# Altium project PPC_notebook_electrical_schematics_v0.6.PrjPcb (part 8 of 10)

## Sheet 27 Clock 2.SchDoc
size 420 x 297 mm
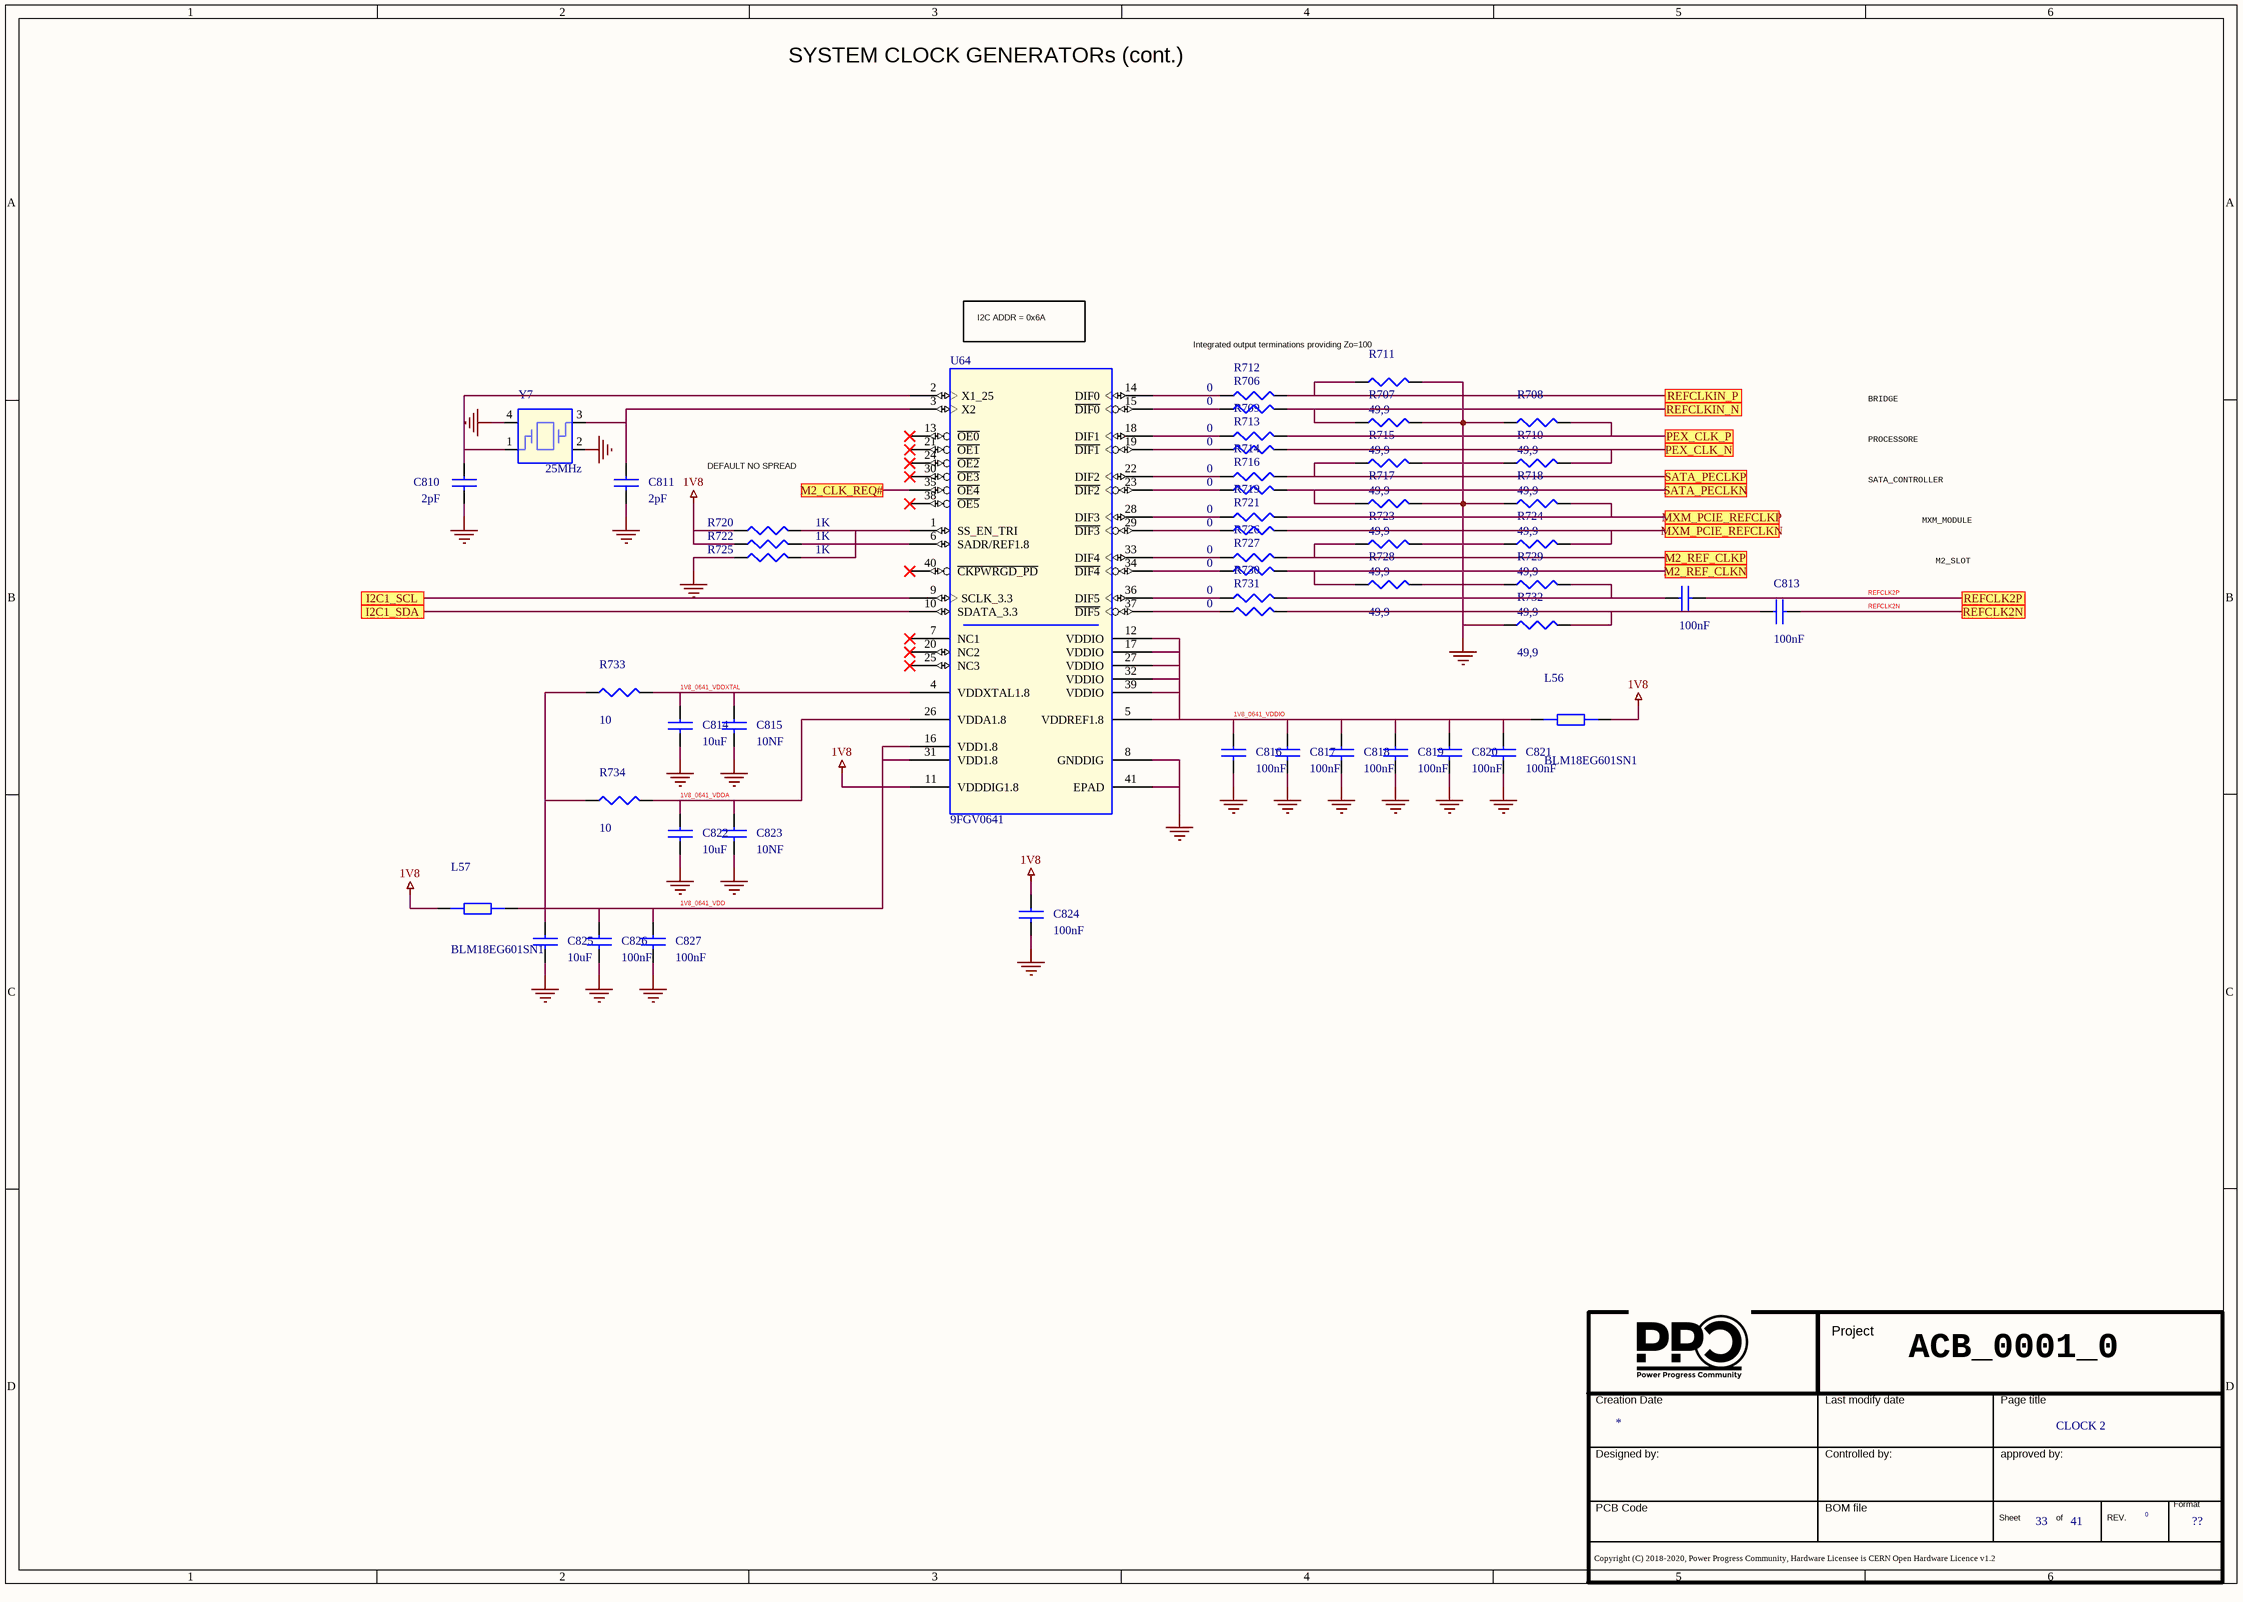
[diagram p59: 27 Clock 2.SchDoc]

### Parts
(Parts that share a designator on the sheet are numbered #1, #2 ... from top to bottom, then left to right.)
*#36  Doc: CLOCK 2  Page Count: 41  Page Number: 33  Page Size: ??  RevCode: 0  (hidden comment: Title_block_PPC)  (graphical)
C810  2pF  [SMD_0402]
C811  2pF  [SMD_0402]
C812  100nF  [SMD_0402]
C813  100nF  [SMD_0402]
C814  10uF  [SMD_0603]
C815  10NF  [SMD_0402]
C816  100nF  [SMD_0402]
C817  100nF  [SMD_0402]
C818  100nF  [SMD_0402]
C819  100nF  [SMD_0402]
C820  100nF  [SMD_0402]
C821  100nF  [SMD_0402]
C822  10uF  [SMD_0603]
C823  10NF  [SMD_0402]
C824  100nF  [SMD_0402]
C825  10uF  [SMD_0603]
C826  100nF  [SMD_0402]
C827  100nF  [SMD_0402]
L56  BLM18EG601SN1  [SMD_0603]
L57  BLM18EG601SN1  [SMD_0603]
R706  0  [SMD_0402]
R707  49,9  [SMD_0402]
R708  49,9  [SMD_0402]
R709  0  [SMD_0402]
R710  49,9  [SMD_0402]
R711  49,9  [SMD_0402]
R712  0  [SMD_0402]
R713  0  [SMD_0402]
R714  0  [SMD_0402]
R715  49,9  [SMD_0402]
R716  0  [SMD_0402]
R717  49,9  [SMD_0402]
R718  49,9  [SMD_0402]
R719  0  [SMD_0402]
R720  1K  [SMD_0402]
R721  0  [SMD_0402]
R722  1K  [SMD_0402]
R723  49,9  [SMD_0402]
R724  49,9  [SMD_0402]
R725  1K  [SMD_0402]
R726  0  [SMD_0402]
R727  0  [SMD_0402]
R728  49,9  [SMD_0402]
R729  49,9  [SMD_0402]
R730  0  [SMD_0402]
R731  0  [SMD_0402]
R732  49,9  [SMD_0402]
R733  10  [SMD_0402]
R734  10  [SMD_0402]
U64  9FGV0641  [qfn_p040_d040_b500_40_e380]
Y7  25MHz  [SMD_5.0x3.2]

### Ports
I2C1_SCL, I2C1_SDA, M2_CLK_REQ#, M2_REF_CLKN, M2_REF_CLKP, MXM_PCIE_REFCLKN, MXM_PCIE_REFCLKP, PEX_CLK_N, PEX_CLK_P, REFCLK2N, REFCLK2P, REFCLKIN_N, REFCLKIN_P, SATA_PECLKN, SATA_PECLKP

### Nets
1V8: C824.1 L56.2 L57.1 R720.1 R722.1 U64.11(VDDDIG1.8)
GND: C810.2 C811.2 C814.2 C815.2 C816.2 C817.2 C818.2 C819.2 C820.2 C821.2 C822.2 C823.2 C824.2 C825.2 C826.2 C827.2 R707.2 R708.1 R710.1 R711.2 R715.2 R717.2 R718.1 R723.2 R724.1 R725.1 R728.2 R729.1 R732.1 U64.8(GNDDIG) U64.41(EPAD) Y7.2 Y7.4
1V8_0641_VDD: C825.1 C826.1 C827.1 L57.2 R733.1 R734.1 U64.16(VDD1.8) U64.31(VDD1.8)
1V8_0641_VDDA: C822.1 C823.1 R734.2 U64.26(VDDA1.8)
1V8_0641_VDDIO: C816.1 C817.1 C818.1 C819.1 C820.1 C821.1 L56.1 U64.5(VDDREF1.8) U64.12(VDDIO) U64.17(VDDIO) U64.27(VDDIO) U64.32(VDDIO) U64.39(VDDIO)
1V8_0641_VDDXTAL: C814.1 C815.1 R733.2 U64.4(VDDXTAL1.8)
REFCLK2N: C813.2 ; port REFCLK2N
REFCLK2P: C812.2 ; port REFCLK2P
REFCLKIN_N: R706.2 R707.1 ; port REFCLKIN_N
REFCLKIN_P: R711.1 R712.2 ; port REFCLKIN_P
NetC113_1: R710.2 R713.2 ; port PEX_CLK_N
NetC114_1: R708.2 R709.2 ; port PEX_CLK_P
NetC810_1: C810.1 U64.2(X1_25) Y7.1
NetC811_1: C811.1 U64.3(X2) Y7.3
NetC812_1: C812.1 R729.2 R730.2
NetC813_1: C813.1 R731.2 R732.2
NetJ13_53: R727.2 R728.1 ; port M2_REF_CLKN
NetJ13_55: R723.1 R726.2 ; port M2_REF_CLKP
NetJ18_153: R721.2 R724.2 ; port MXM_PCIE_REFCLKN
NetJ18_155: R718.2 R719.2 ; port MXM_PCIE_REFCLKP
NetR108_1: U64.10(SDATA_3.3) ; port I2C1_SDA
NetR109_1: U64.9(SCLK_3.3) ; port I2C1_SCL
NetR420_2: R714.2 R715.1 ; port SATA_PECLKP
NetR421_2: R716.2 R717.1 ; port SATA_PECLKN
NetR435_1: U64.35(~{OE4}) ; port M2_CLK_REQ#
NetR706_1: R706.1 U64.15(~{DIF0})
NetR709_1: R709.1 U64.18(DIF1)
NetR712_1: R712.1 U64.14(DIF0)
NetR713_1: R713.1 U64.19(~{DIF1})
NetR714_1: R714.1 U64.22(DIF2)
NetR716_1: R716.1 U64.23(~{DIF2})
NetR719_1: R719.1 U64.28(DIF3)
NetR720_2: R720.2 R725.2 U64.1(SS_EN_TRI)
NetR721_1: R721.1 U64.29(~{DIF3})
NetR722_2: R722.2 U64.6(SADR/REF1.8)
NetR726_1: R726.1 U64.33(DIF4)
NetR727_1: R727.1 U64.34(~{DIF4})
NetR730_1: R730.1 U64.36(DIF5)
NetR731_1: R731.1 U64.37(~{DIF5})

Not connected (* = marked no-connect by the designer): U64 7(NC1)* 13(~{OE0})* 20(NC2)* 21(~{OE1})* 24(~{OE2})* 25(NC3)* 30(~{OE3})* 38(~{OE5})* 40(~{CKPWRGD_PD})*

### Notes on the sheet
- SYSTEM CLOCK GENERATORs (cont.)
- I2C ADDR = 0x6A
- Integrated output terminations providing Zo=100
- BRIDGE
- PROCESSORE
- DEFAULT NO SPREAD
- SATA_CONTROLLER
- MXM_MODULE
- M2_SLOT
- ACB_0001_0

### Library data of the parts
*#36 = Title_block_PPC: Title: T2080PCIe; Schematic Page Count: 45; Schematic Page Number: 36; Author: MICETEK; Page Create Date: March  8, 1995; Page Title: ?; Page Modify Date: *
C810 = CAP NP_Dup2: CAP CER 2PF 50V C0G/NPO 0402; Part Number: PASSIVE_1453; Manufacturer 1: YAGEO; Manufacturer Part Number 1: CC0402CRNPO9BN2R0D; RSM: RC0402; Part Type: Capacitors\Ceramic\SMD\0402; PCB Footprint: SMD_0402
C811 = CAP NP_Dup2: CAP CER 2PF 50V C0G/NPO 0402; Manufacturer Part Number 1: CC0402CRNPO9BN2R0D; Manufacturer 1: YAGEO; Part Number: PASSIVE_1453; RSM: RC0402; PCB Footprint: SMD_0402; Part Type: Capacitors\Ceramic\SMD\0402
C812 C813 = CAP NP_Dup2: COND.CER. 100NF 50V 0402 X7R SMD; Manufacturer Part Number 1: CGA2B3X7R1H104M050BD; Manufacturer 1: TDK; Part Number: PASSIVE_24; RSM: RC0402; PCB Footprint: SMD_0402; Part Type: Capacitors\Ceramic\SMD\0402
C814 C822 C825 = CAP NP_Dup2: COND.CER.10uF 0603 25V SMD; Manufacturer Part Number 1: CL10A106MA8NRNC; Manufacturer 1: SAMSUNG; Part Number: PASSIVE_124; RSM: RC0603; PCB Footprint: SMD_0603; Part Type: Capacitors\Ceramic\SMD\0603
C815 C823 = CAP NP_Dup2: COND.CER. 10NF 16V 0402 X7R SMD; Part Number: PASSIVE_28; Manufacturer 1: AVX; Manufacturer Part Number 1: 0402YC103KAT2A; RSM: RC0402; Part Type: Capacitors\Ceramic\SMD\0402; PCB Footprint: SMD_0402
C816-C821 C824 C826 C827 = CAP NP_Dup2: COND.CER. 100NF 50V 0402 X7R SMD; Part Number: PASSIVE_24; Manufacturer 1: TDK; Manufacturer Part Number 1: CGA2B3X7R1H104M050BD; RSM: RC0402; Part Type: Capacitors\Ceramic\SMD\0402; PCB Footprint: SMD_0402
L56 L57 = FERRITE_BEAD: FERRITE BEAD 600ohm 500mA 0603 SMD; Manufacturer Part Number 1: BLM18EG601SN1 SMD; Manufacturer 1: Murata; Part Number: PASSIVE_377; RSM: RC0603; Part Type: Ferrite Beads\SMD\0603; PCB Footprint: SMD_0603
R706 R709 R712-R714 R716 R719 R721 R726 R727 R730 R731 = R_Dup5: RESIS.CHIP 0R 5% 0402 SMD; Part Number: PASSIVE_805; Manufacturer 1: ROYAL OHM; RSM: RC0402; Part Type: Resistors\Fixed\SMD\0402\5%; Manufacturer Part Number 1: RESIS.CHIP 0R 5% 0402 SMD; PCB Footprint: SMD_0402
R707 R708 R710 R711 R715 R717 R718 R723 R724 R728 R729 R732 = R_Dup5: RESIS.CHIP 49,9R 1% 0402 SMD; Manufacturer Part Number 1: NCR04F49R9TRF; Manufacturer 1: NIC; Part Number: PASSIVE_738; RSM: RC0402; Part Type: Resistors\Fixed\SMD\0402\1%; PCB Footprint: SMD_0402
R720 R722 R725 = R_Dup5: RESIS.CHIP 1K 1% 0402 SMD; Part Number: PASSIVE_628; Manufacturer 1: ROYAL OHM; RSM: RC0402; Part Type: Resistors\Fixed\SMD\0402\1%; Manufacturer Part Number 1: RESIS.CHIP 1K 1% 0402 SMD; PCB Footprint: SMD_0402
R733 R734 = R_Dup5: RESIS.CHIP 10R 5% 0402 SMD; Manufacturer 1: ROYAL OHM; Part Number: PASSIVE_811; RSM: RC0402; Manufacturer Part Number 1: RESIS.CHIP 10R 5% 0402 SMD; Part Type: Resistors\Fixed\SMD\0402\5%; PCB Footprint: SMD_0402
U64 = IDT9FGV0641: PCIe Gen1–4 clock generation for Riser Cards; Manufacturer 1: IDT; Part Number: LOGIC_359; MPN: 9FGV0641AKLF; RSM: QFN-40-5X5-P0_4-EP; PCB Footprint: 40-VFQFPN; Distributor 1: IDT; Manufacturer Part Number 1: 9FGV0641; Part Type: CLOCK\GENERATOR; TYPE: IC; Vendor: IDT
Y7 = CRYSTAL_4P: CRYSTAL 25.000 MHZ 20PF SMD; Manufacturer Part Number 1: ECS-250-20-30B-TR (ROHS COMPLIANT); Manufacturer 1: ECS; Part Number: MISC_166; RSM: XC-CSX2; PCB Footprint: SMD_5.0x3.2; Distributor 1: DIGIKEY (XC1124CT-ND); Part Type: Quartz

## Sheet 28 Core Pwr.SchDoc
size 420 x 297 mm
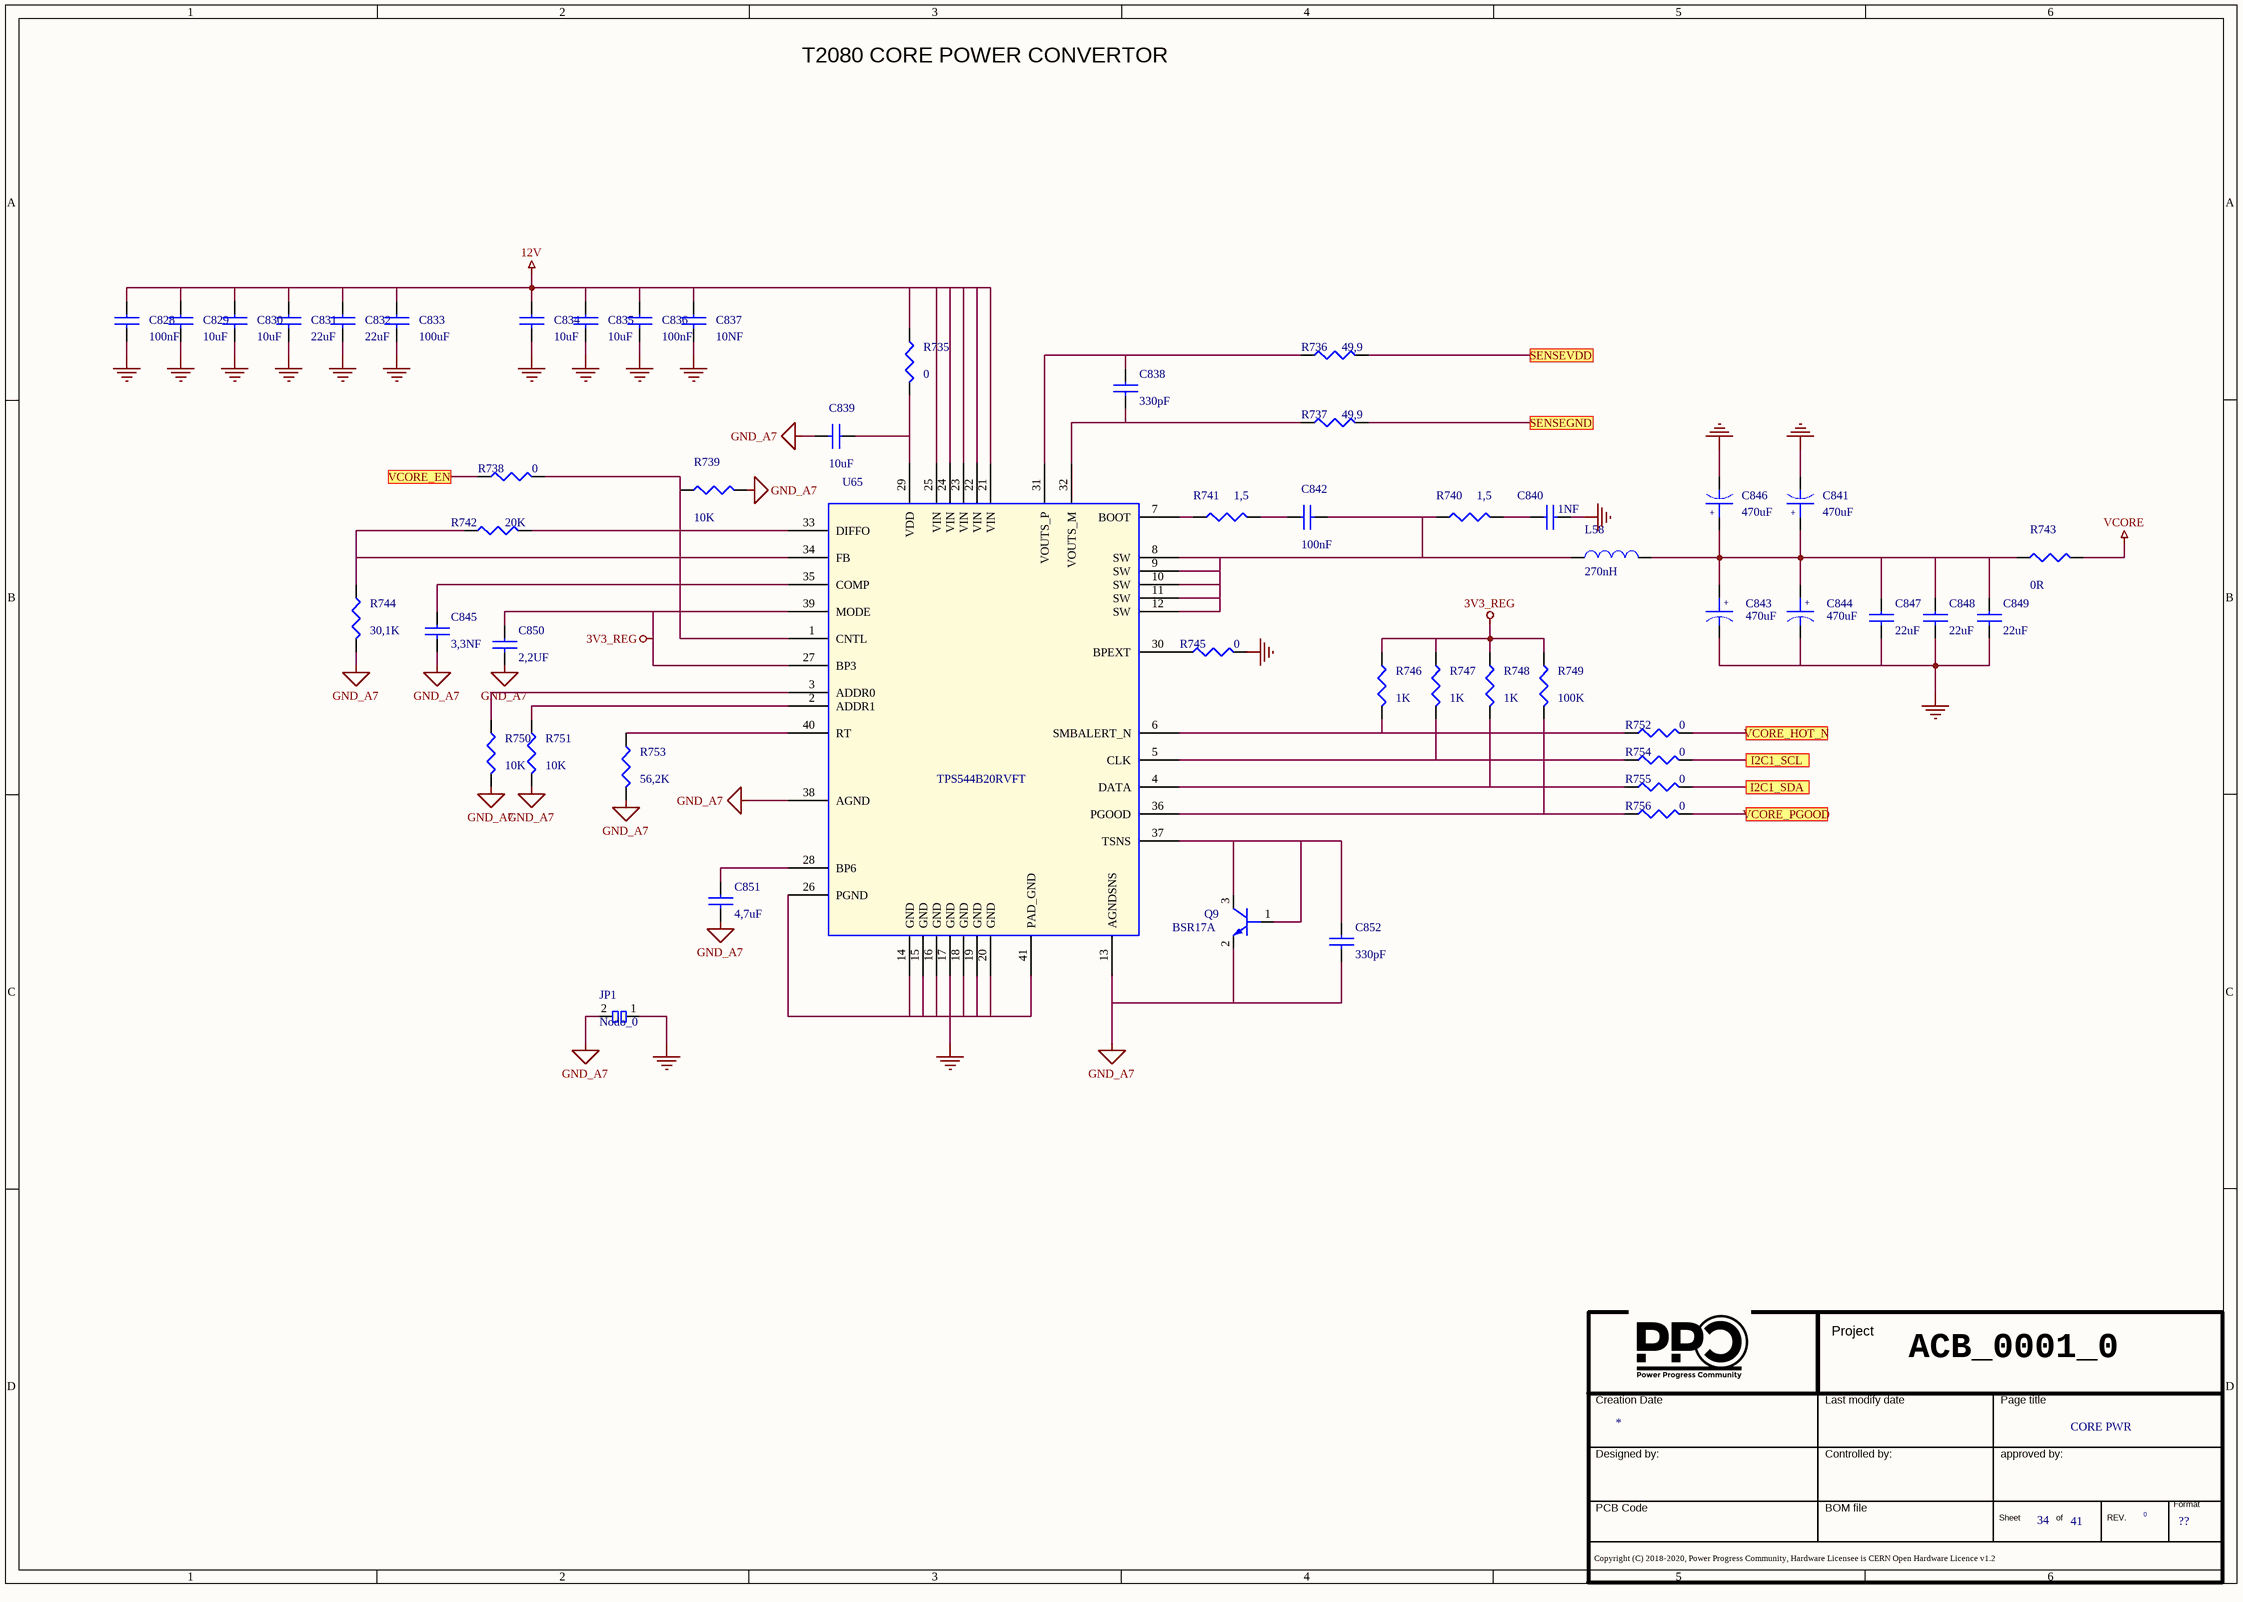
[diagram p60: 28 Core Pwr.SchDoc]

### Parts
(Parts that share a designator on the sheet are numbered #1, #2 ... from top to bottom, then left to right.)
*#37  Doc: CORE PWR  Page Count: 41  Page Number: 34  Page Size: ??  RevCode: 0  (hidden comment: Title_block_PPC)  (graphical)
C828  100nF  [SMD_0402]
C829  10uF  [SMD_0603]
C830  10uF  [SMD_0603]
C831  22uF  [SMD_0805]
C832  22uF  [SMD_0805]
C833  100uF  [SMD_1210]
C834  10uF  [SMD_0603]
C835  10uF  [SMD_0603]
C836  100nF  [SMD_0402]
C837  10NF  [SMD_0402]
C838  330pF  [SMD_0402]
C839  10uF  [SMD_0603]
C840  1NF  [SMD_0402]
C841  470uF  [SMD_CASE_GX]
C842  100nF  [SMD_0402]
C843  470uF  [SMD_CASE_GX]
C844  470uF  [SMD_CASE_GX]
C845  3,3NF  [SMD_0402]
C846  470uF  [SMD_CASE_GX]
C847  22uF  [SMD_1206]
C848  22uF  [SMD_1206]
C849  22uF  [SMD_1206]
C850  2,2UF  [SMD_0402]
C851  4,7uF  [SMD_0402]
C852  330pF  [SMD_0402]
JP1  Nodo_0
L58  270nH  [SMD_7_65X11mm]
Q9  BSR17A  [SOT_23]
R735  0  [SMD_1206]
R736  49,9  [SMD_0402]
R737  49,9  [SMD_0402]
R738  0  [SMD_0402]
R739  10K  [SMD_0402]
R740  1,5  [SMD_0402]
R741  1,5  [SMD_0402]
R742  20K  [SMD_0402]
R743  0R  [SMD_2010]
R744  30,1K  [SMD_0402]
R745  0  [SMD_0402]
R746  1K  [SMD_0402]
R747  1K  [SMD_0402]
R748  1K  [SMD_0402]
R749  100K  [SMD_0402]
R750  10K  [SMD_0402]
R751  10K  [SMD_0402]
R752  0  [SMD_0402]
R753  56,2K  [SMD_0402]
R754  0  [SMD_0402]
R755  0  [SMD_0402]
R756  0  [SMD_0402]
U65  TPS544B20RVFT  [LQFN40]

### Ports
I2C1_SCL, I2C1_SDA, SENSEGND, SENSEVDD, VCORE_EN, VCORE_HOT_N, VCORE_PGOOD

### Nets
3V3_REG: C850.1 R746.1 R747.1 R748.1 R749.1 U65.27(BP3) U65.39(MODE)
12V: C828.1 C829.1 C830.1 C831.1 C832.1 C833.1 C834.1 C835.1 C836.1 C837.1 R735.1 U65.21(VIN) U65.22(VIN) U65.23(VIN) U65.24(VIN) U65.25(VIN)
GND: C828.2 C829.2 C830.2 C831.2 C832.2 C833.2 C834.2 C835.2 C836.2 C837.2 C840.2 C841.2 C843.2 C844.2 C846.2 C847.2 C848.2 C849.2 JP1.1 R745.2 U65.14(GND) U65.15(GND) U65.16(GND) U65.17(GND) U65.18(GND) U65.19(GND) U65.20(GND) U65.26(PGND) U65.41(PAD_GND)
GND_A7: C839.2 C845.2 C850.2 C851.2 C852.2 JP1.2 Q9.2(E) R739.2 R744.2 R750.2 R751.2 R753.2 U65.13(AGNDSNS) U65.38(AGND)
VCORE: R743.2
NetC838_1: C838.1 R736.1 U65.31(VOUTS_P)
NetC838_2: C838.2 R737.1 U65.32(VOUTS_M)
NetC839_1: C839.1 R735.2 U65.29(VDD)
NetC840_1: C840.1 R740.2
NetC841_1: C841.1 C843.1 C844.1 C846.1 C847.1 C848.1 C849.1 L58.2 R743.1
NetC842_1: C842.1 R741.2
NetC842_2: C842.2 L58.1 R740.1 U65.8(SW) U65.9(SW) U65.10(SW) U65.11(SW) U65.12(SW)
NetC845_1: C845.1 U65.35(COMP)
NetC851_1: C851.1 U65.28(BP6)
NetC852_1: C852.1 Q9.1(B) Q9.3(C) U65.37(TSNS)
NetR108_1: R755.2 ; port I2C1_SDA
NetR109_1: R754.2 ; port I2C1_SCL
NetR292_2: R738.1 ; port VCORE_EN
NetR338_2: R756.2 ; port VCORE_PGOOD
NetR342_2: R752.2 ; port VCORE_HOT_N
NetR736_2: R736.2 ; port SENSEVDD
NetR737_2: R737.2 ; port SENSEGND
NetR738_2: R738.2 R739.1 U65.1(CNTL)
NetR741_1: R741.1 U65.7(BOOT)
NetR742_1: R742.1 R744.1 U65.34(FB)
NetR742_2: R742.2 U65.33(DIFFO)
NetR745_1: R745.1 U65.30(BPEXT)
NetR746_2: R746.2 R752.1 U65.6(SMBALERT_N)
NetR747_2: R747.2 R754.1 U65.5(CLK)
NetR748_2: R748.2 R755.1 U65.4(DATA)
NetR749_2: R749.2 R756.1 U65.36(PGOOD)
NetR750_1: R750.1 U65.3(ADDR0)
NetR751_1: R751.1 U65.2(ADDR1)
NetR753_1: R753.1 U65.40(RT)

### Notes on the sheet
- T2080 CORE POWER CONVERTOR
- ACB_0001_0
- (in symbol CAP POL) +

### Library data of the parts
*#37 = Title_block_PPC: Title: T2080PCIe; Schematic Page Count: 45; Schematic Page Number: 37; Author: MICETEK; Page Create Date: March  8, 1995; Page Title: ?; Page Modify Date: *
C828 C836 = CAP NP_Dup2: as C812 on sheet 27 Clock 2; PCB Footprint: SMD_0402; Part Type: Capacitors\Ceramic\SMD\0402
C829 C830 C834 C835 C839 = CAP NP_Dup2: COND.CER.10uF 0603 25V SMD; Part Number: PASSIVE_124; Manufacturer 1: SAMSUNG; Manufacturer Part Number 1: CL10A106MA8NRNC; RSM: RC0603; PCB Footprint: SMD_0603; Part Type: Capacitors\Ceramic\SMD\0603
C831 C832 = CAP NP_Dup2: 22UF 35V 20% 0805; Part Number: PASSIVE_224; Manufacturer 1: TDK; Manufacturer Part Number 1: C2012X5R1V226M125AC; RSM: RC0805; PCB Footprint: SMD_0805; Part Type: Capacitors\Ceramic\SMD\0805
C833 = CAP NP_Dup2: CAP CER 100UF 16V 20% X5R 1210; Part Number: PASSIVE_264; Manufacturer 1: Taiyo Yuden; Manufacturer Part Number 1: EMK325ABJ107MM-T; RSM: RC1210; PCB Footprint: SMD_1210; Part Type: Capacitors\Ceramic\SMD\1210
C837 = CAP NP_Dup2: COND.CER. 10NF 16V 0402 X7R SMD; Manufacturer Part Number 1: 0402YC103KAT2A; Manufacturer 1: AVX; Part Number: PASSIVE_28; RSM: RC0402; PCB Footprint: SMD_0402; Part Type: Capacitors\Ceramic\SMD\0402
C838 C852 = CAP NP_Dup2: CAP CER 330PF 50V 5% C0G 0402 HiRel; Manufacturer Part Number 1: CGJ2B2C0G1H331J050BA; Manufacturer 1: TDK; Part Number: PASSIVE_73; RSM: RC0402; PCB Footprint: SMD_0402; Part Type: Capacitors\Ceramic\SMD\0402
C840 = CAP NP_Dup2: COND.CER. 1NF 50V 0402 X7R SMD; Manufacturer Part Number 1: GRM15XR71H102KA86D; Manufacturer 1: Murata; Part Number: PASSIVE_47; RSM: RC0402; PCB Footprint: SMD_0402; Part Type: Capacitors\Ceramic\SMD\0402
C841 C846 = CAP POL: COND.TANT. 470uF 2v CASE-GX SMD; Part Number: PASSIVE_1473; Manufacturer 1: PANASONIC; Manufacturer Part Number 1: EEF-GX0D471R; RSM: TANT-D; PCB Footprint: SMD_CASE_GX; Part Type: Capacitors\Tantalum\SMD\CASE_GX
C842 = CAP NP_Dup2: as C816-C821 on sheet 27 Clock 2; PCB Footprint: SMD_0402; Part Type: Capacitors\Ceramic\SMD\0402
C843 C844 = CAP POL: COND.TANT. 470uF 2v CASE-GX SMD; Manufacturer Part Number 1: EEF-GX0D471R; Manufacturer 1: PANASONIC; Part Number: PASSIVE_1473; RSM: TANT-D; PCB Footprint: SMD_CASE_GX; Part Type: Capacitors\Tantalum\SMD\CASE_GX
C845 = CAP NP_Dup2: COND.CER. 3,3NF 50V 0402 X7R SMD; Part Number: PASSIVE_69; RSM: RC0402; PCB Footprint: SMD_0402; Part Type: Capacitors\Ceramic\SMD\0402
C847-C849 = CAP NP_Dup2: CAP CER 22UF 16V 10% X5R 1206; Manufacturer Part Number 1: CL31A226KOHNNNE; Manufacturer 1: SAMSUNG; Part Number: PASSIVE_258; RSM: RC1206; PCB Footprint: SMD_1206; Part Type: Capacitors\Ceramic\SMD\1206
C850 = CAP NP_Dup2: CAP CER 2.2UF 25V X5R 0402; Manufacturer Part Number 1: GRM155R61E225ME15D; Manufacturer 1: Murata; Part Number: PASSIVE_1411; RSM: RC0402; PCB Footprint: SMD_0402; Part Type: Capacitors\Ceramic\SMD\0402
C851 = CAP NP_Dup2: CAP CER 4.7UF 10V 20% X5R 0402; Part Number: PASSIVE_80; Manufacturer 1: TDK; Manufacturer Part Number 1: C1005X5R1A475M050BC; RSM: RC0402; PCB Footprint: SMD_0402; Part Type: Capacitors\Ceramic\SMD\0402
JP1 = JUMPER_0: Serve solo al masterista per collegare i gnd; LNK_PART: SEZ0201_CHIUSO; Part Number: DA CODIFICARE; TECNO77: NODO; Part Type: NODO; RSM: NODO
L58 = INDUCTOR_Dup1: Induttori fissi 270nH Shld 20% 35.5A 228mOhms; Manufacturer Part Number 1: SLC1175-271MEB; Manufacturer 1: Coilcraft; Part Number: PASSIVE_1472; RSM: IND-BOURNS-SLC1175; PCB Footprint: SMD_7_65X11mm; Part Type: Inductors\SMD
Q9 = NPN BEC: TRANS NPN 40V 0.2A SOT-23; Manufacturer 1: ON Semi; Part Number: DISCRETE_327; PCB Footprint: SOT_23; Distributor 1: DIGIKEY ( / DIGIKEY(BSR17ATR-ND); Manufacturer Part Number 1: BSR17A; Part Type: Transistors\Bipolar\NPN; RSM: SOT-23
R735 = R_Dup5: RESIS. 0R 1/4W 1206 SMD E96; Manufacturer Part Number 1: RC1206JR-070RL; Manufacturer 1: YAGEO; Part Number: PASSIVE_1266; RSM: RC1206; PCB Footprint: SMD_1206; Part Type: Resistors\Fixed\SMD\1206\5%
R736 R737 = R_Dup5: RESIS.CHIP 49,9R 1% 0402 SMD; Part Number: PASSIVE_738; Manufacturer 1: NIC; Manufacturer Part Number 1: NCR04F49R9TRF; RSM: RC0402; PCB Footprint: SMD_0402; Part Type: Resistors\Fixed\SMD\0402\1%
R738 R745 R752 R754-R756 = R_Dup5: as R706 on sheet 27 Clock 2; PCB Footprint: SMD_0402; Part Type: Resistors\Fixed\SMD\0402\5%; Manufacturer Part Number 1: RESIS.CHIP 0R 5% 0402 SMD
R739 R750 R751 = R_Dup5: RESIS.CHIP 10K 5% 0402 SMD; Part Number: PASSIVE_814; Manufacturer 1: ROYAL OHM; RSM: RC0402; PCB Footprint: SMD_0402; Part Type: Resistors\Fixed\SMD\0402\5%; Manufacturer Part Number 1: RESIS.CHIP 10K 5% 0402 SMD
R740 R741 = R_Dup5: RESIS.CHIP 1,5OHM 1% 0402 SMD; Part Number: PASSIVE_573; Manufacturer 1: WELWYN; Manufacturer Part Number 1: ASC0402-1R5FT10; RSM: RC0402; PCB Footprint: SMD_0402; Part Type: Resistors\Fixed\SMD\0402\1%
R742 = R_Dup5: RESIS.CHIP 20K 1% 0402 SMD; Manufacturer Part Number 1: RC0402FR-1320KL; Manufacturer 1: YAGEO; Part Number: PASSIVE_641; RSM: RC0402; PCB Footprint: SMD_0402; Part Type: Resistors\Fixed\SMD\0402\1%
R743 = R_Dup5: RESIS. CHIP 0R 1/4W 1% 2010 SMD; Part Number: PASSIVE_1310; Manufacturer 1: Vishay; Manufacturer Part Number 1: CRCW20100000Z0EF; RSM: RC2010; PCB Footprint: SMD_2010; Part Type: Resistors\Fixed\SMD\2010\1%
R744 = R_Dup5: RESIS.CHIP 30K1 1% 0402 SMD; Manufacturer 1: ROYAL OHM; Part Number: PASSIVE_683; RSM: RC0402; PCB Footprint: SMD_0402; Manufacturer Part Number 1: RESIS.CHIP 30K1 1% 0402 SMD; Part Type: Resistors\Fixed\SMD\0402\1%
R746 = R_Dup5: RESIS.CHIP 1K 5% 0402 SMD; Manufacturer 1: ROYAL OHM; Part Number: PASSIVE_832; RSM: RC0402; PCB Footprint: SMD_0402; Manufacturer Part Number 1: RESIS.CHIP 1K 5% 0402 SMD; Part Type: Resistors\Fixed\SMD\0402\5%
R747 R748 = R_Dup5: RESIS.CHIP 1K 5% 0402 SMD; Part Number: PASSIVE_832; Manufacturer 1: ROYAL OHM; RSM: RC0402; PCB Footprint: SMD_0402; Part Type: Resistors\Fixed\SMD\0402\5%; Manufacturer Part Number 1: RESIS.CHIP 1K 5% 0402 SMD
R749 = R_Dup5: RESIS.CHIP 100K 5% 0402 SMD; Part Number: PASSIVE_813; Manufacturer 1: ROYAL OHM; RSM: RC0402; PCB Footprint: SMD_0402; Part Type: Resistors\Fixed\SMD\0402\5%; Manufacturer Part Number 1: RESIS.CHIP 100K 5% 0402 SMD
R753 = R_Dup5: RESIS.CHIP 56,2K 1% 0402 SMD; Manufacturer 1: ROYAL OHM; Part Number: PASSIVE_755; RSM: RC0402; PCB Footprint: SMD_0402; Manufacturer Part Number 1: RESIS.CHIP 56,2K 1% 0402 SMD; Part Type: Resistors\Fixed\SMD\0402\1%
U65 = TPS544X20: IC REG BUCK ADJ 20A 40LQFN; Part Number: LINEAR_334; Manufacturer 1: TEXAS; RSM: LQFN-40-EP-7_1X5_1; PCB Footprint: LQFN40; Part Type: Regulators\Switching; Manufacturer Part Number 1: TPS544B20RVFT; Distributor 1: DIGIKEY(296-37876-1-ND)

## Sheet 29 Other Pwr 1.SchDoc
size 420 x 297 mm
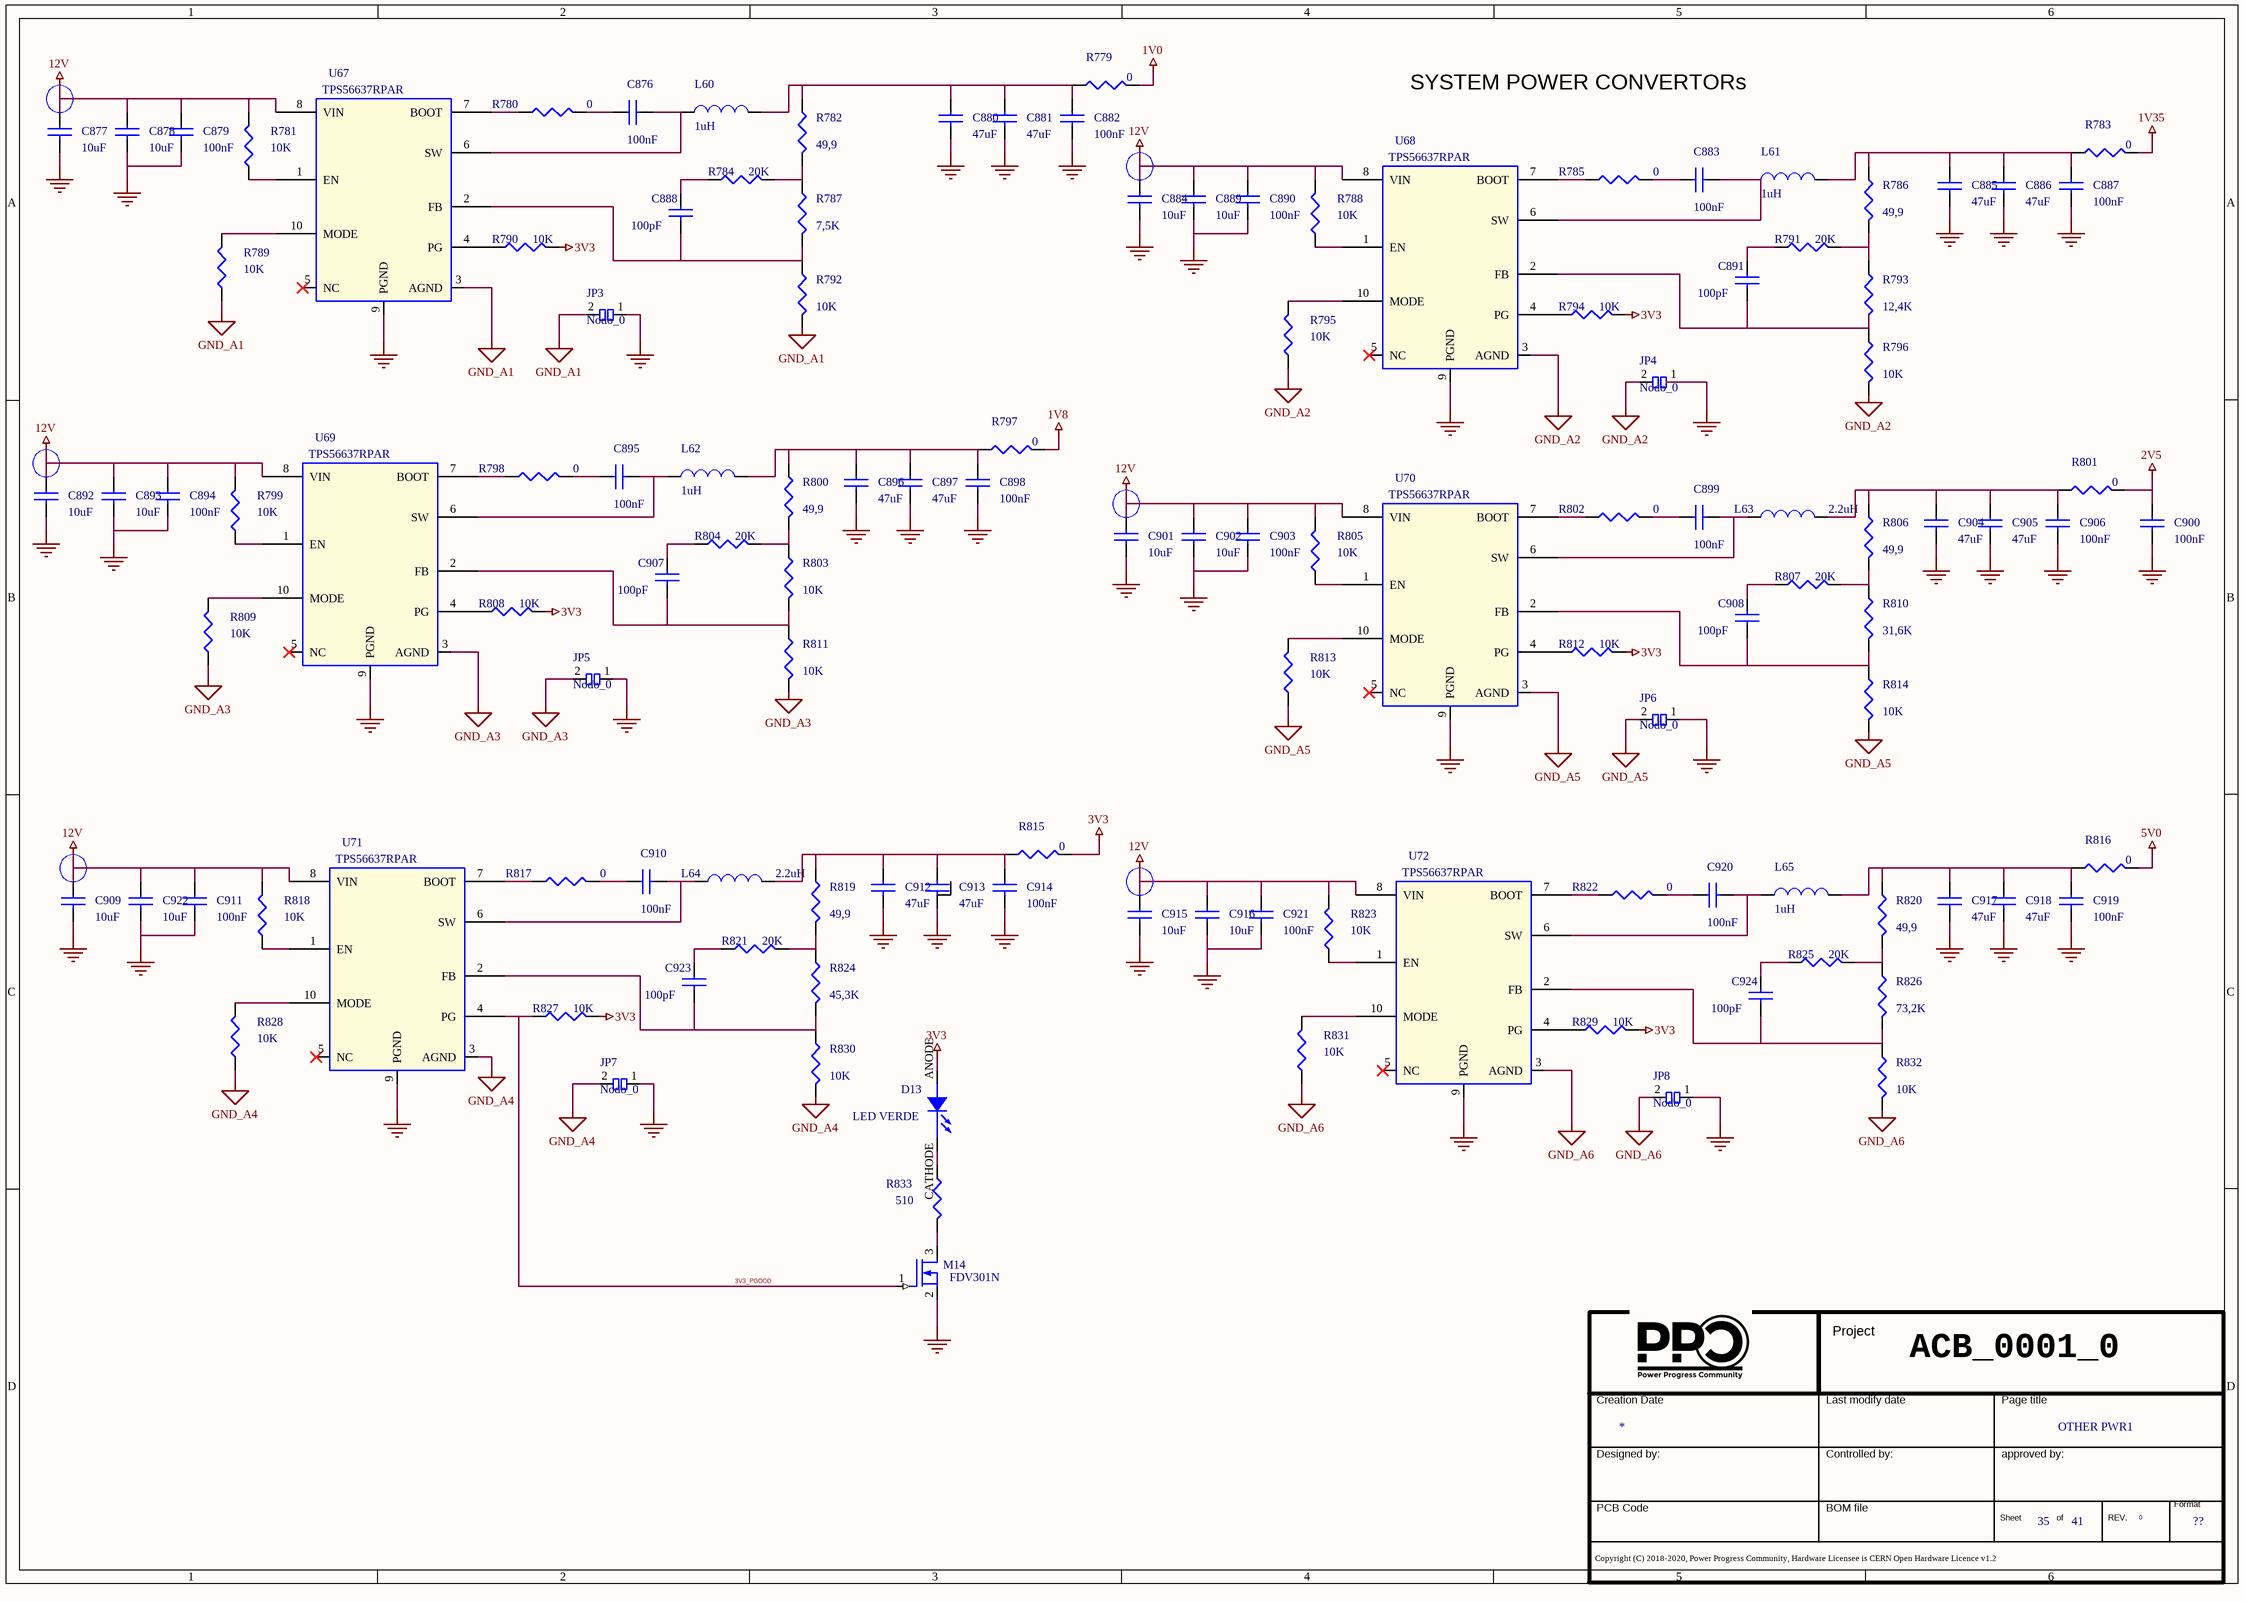
[diagram p61: 29 Other Pwr 1.SchDoc]

### Parts
(Parts that share a designator on the sheet are numbered #1, #2 ... from top to bottom, then left to right.)
*#38  Doc: OTHER PWR1  Page Count: 41  Page Number: 35  Page Size: ??  RevCode: 0  (hidden comment: Title_block_PPC)  (graphical)
C876  100nF  [SMD_0402]
C877  10uF  [SMD_0603]
C878  10uF  [SMD_0603]
C879  100nF  [SMD_0402]
C880  47uF  [SMD_0805]
C881  47uF  [SMD_0805]
C882  100nF  [SMD_0402]
C883  100nF  [SMD_0402]
C884  10uF  [SMD_0603]
C885  47uF  [SMD_0805]
C886  47uF  [SMD_0805]
C887  100nF  [SMD_0402]
C888  100pF  [SMD_0402]
C889  10uF  [SMD_0603]
C890  100nF  [SMD_0402]
C891  100pF  [SMD_0402]
C892  10uF  [SMD_0603]
C893  10uF  [SMD_0603]
C894  100nF  [SMD_0402]
C895  100nF  [SMD_0402]
C896  47uF  [SMD_0805]
C897  47uF  [SMD_0805]
C898  100nF  [SMD_0402]
C899  100nF  [SMD_0402]
C900  100nF  [SMD_0402]
C901  10uF  [SMD_0603]
C902  10uF  [SMD_0603]
C903  100nF  [SMD_0402]
C904  47uF  [SMD_0805]
C905  47uF  [SMD_0805]
C906  100nF  [SMD_0402]
C907  100pF  [SMD_0402]
C908  100pF  [SMD_0402]
C909  10uF  [SMD_0603]
C910  100nF  [SMD_0402]
C911  100nF  [SMD_0402]
C912  47uF  [SMD_0805]
C913  47uF  [SMD_0805]
C914  100nF  [SMD_0402]
C915  10uF  [SMD_0603]
C916  10uF  [SMD_0603]
C917  47uF  [SMD_0805]
C918  47uF  [SMD_0805]
C919  100nF  [SMD_0402]
C920  100nF  [SMD_0402]
C921  100nF  [SMD_0402]
C922  10uF  [SMD_0603]
C923  100pF  [SMD_0402]
C924  100pF  [SMD_0402]
D13  LED VERDE  [led_0603]
JP3  Nodo_0
JP4  Nodo_0
JP5  Nodo_0
JP6  Nodo_0
JP7  Nodo_0
JP8  Nodo_0
L60  1uH  [SMD]
L61  1uH  [SMD]
L62  1uH  [SMD]
L63  2.2uH  [SMD]
L64  2.2uH  [SMD]
L65  1uH  [SMD]
M14  FDV301N  [sot23]
R779  0  [SMD_1206]
R780  0  [SMD_0402]
R781  10K  [SMD_0402]
R782  49,9  [SMD_0402]
R783  0  [SMD_1206]
R784  20K  [SMD_0402]
R785  0  [SMD_0402]
R786  49,9  [SMD_0402]
R787  7,5K  [SMD_0402]
R788  10K  [SMD_0402]
R789  10K  [SMD_0402]
R790  10K  [SMD_0402]
R791  20K  [SMD_0402]
R792  10K  [SMD_0402]
R793  12,4K  [SMD_0402]
R794  10K  [SMD_0402]
R795  10K  [SMD_0402]
R796  10K  [SMD_0402]
R797  0  [SMD_1206]
R798  0  [SMD_0402]
R799  10K  [SMD_0402]
R800  49,9  [SMD_0402]
R801  0  [SMD_1206]
R802  0  [SMD_0402]
R803  10K  [SMD_0402]
R804  20K  [SMD_0402]
R805  10K  [SMD_0402]
R806  49,9  [SMD_0402]
R807  20K  [SMD_0402]
R808  10K  [SMD_0402]
R809  10K  [SMD_0402]
R810  31,6K  [SMD_0402]
R811  10K  [SMD_0402]
R812  10K  [SMD_0402]
R813  10K  [SMD_0402]
R814  10K  [SMD_0402]
R815  0  [SMD_1206]
R816  0  [SMD_1206]
R817  0  [SMD_0402]
R818  10K  [SMD_0402]
R819  49,9  [SMD_0402]
R820  49,9  [SMD_0402]
R821  20K  [SMD_0402]
R822  0  [SMD_0402]
R823  10K  [SMD_0402]
R824  45,3K  [SMD_0402]
R825  20K  [SMD_0402]
R826  73,2K  [SMD_0402]
R827  10K  [SMD_0402]
R828  10K  [SMD_0402]
R829  10K  [SMD_0402]
R830  10K  [SMD_0402]
R831  10K  [SMD_0402]
R832  10K  [SMD_0402]
R833  510  [SMD_0402]
U67  TPS56637RPAR  [VQFN10]
U68  TPS56637RPAR  [VQFN10]
U69  TPS56637RPAR  [VQFN10]
U70  TPS56637RPAR  [VQFN10]
U71  TPS56637RPAR  [VQFN10]
U72  TPS56637RPAR  [VQFN10]

### Nets
1V0: R779.2
1V8: R797.2
1V35: R783.2
2V5: C900.1 R801.2
3V3: D13.ANODE R790.2 R794.2 R808.2 R812.2 R815.2 R827.2 R829.2
5V0: R816.2
12V: C877.1 C878.1 C879.1 C884.1 C889.1 C890.1 C892.1 C893.1 C894.1 C901.1 C902.1 C903.1 C909.1 C911.1 C915.1 C916.1 C921.1 C922.1 R781.2 R788.2 R799.2 R805.2 R818.2 R823.2 U67.8(VIN) U68.8(VIN) U69.8(VIN) U70.8(VIN) U71.8(VIN) U72.8(VIN)
GND: C877.2 C878.2 C879.2 C880.2 C881.2 C882.2 C884.2 C885.2 C886.2 C887.2 C889.2 C890.2 C892.2 C893.2 C894.2 C896.2 C897.2 C898.2 C900.2 C901.2 C902.2 C903.2 C904.2 C905.2 C906.2 C909.2 C911.2 C912.2 C913.2 C914.2 C915.2 C916.2 C917.2 C918.2 C919.2 C921.2 C922.2 JP3.1 JP4.1 JP5.1 JP6.1 JP7.1 JP8.1 M14.2(SOURCE) U67.9(PGND) U68.9(PGND) U69.9(PGND) U70.9(PGND) U71.9(PGND) U72.9(PGND)
GND_A1: JP3.2 R789.1 R792.2 U67.3(AGND)
GND_A2: JP4.2 R795.1 R796.2 U68.3(AGND)
GND_A3: JP5.2 R809.1 R811.2 U69.3(AGND)
GND_A4: JP7.2 R828.1 R830.2 U71.3(AGND)
GND_A5: JP6.2 R813.1 R814.2 U70.3(AGND)
GND_A6: JP8.2 R831.1 R832.2 U72.3(AGND)
3V3_PGOOD: M14.1(GATE) R827.1 U71.4(PG)
NetC876_1: C876.1 R780.2
NetC876_2: C876.2 L60.1 U67.6(SW)
NetC880_1: C880.1 C881.1 C882.1 L60.2 R779.1 R782.1
NetC883_1: C883.1 R785.2
NetC883_2: C883.2 L61.1 U68.6(SW)
NetC885_1: C885.1 C886.1 C887.1 L61.2 R783.1 R786.1
NetC888_1: C888.1 R784.1
NetC888_2: C888.2 R787.2 R792.1 U67.2(FB)
NetC891_1: C891.1 R791.1
NetC891_2: C891.2 R793.2 R796.1 U68.2(FB)
NetC895_1: C895.1 R798.2
NetC895_2: C895.2 L62.1 U69.6(SW)
NetC896_1: C896.1 C897.1 C898.1 L62.2 R797.1 R800.1
NetC899_1: C899.1 R802.2
NetC899_2: C899.2 L63.1 U70.6(SW)
NetC904_1: C904.1 C905.1 C906.1 L63.2 R801.1 R806.1
NetC907_1: C907.1 R804.1
NetC907_2: C907.2 R803.2 R811.1 U69.2(FB)
NetC908_1: C908.1 R807.1
NetC908_2: C908.2 R810.2 R814.1 U70.2(FB)
NetC910_1: C910.1 R817.2
NetC910_2: C910.2 L64.1 U71.6(SW)
NetC912_1: C912.1 C913.1 C914.1 L64.2 R815.1 R819.1
NetC917_1: C917.1 C918.1 C919.1 L65.2 R816.1 R820.1
NetC920_1: C920.1 R822.2
NetC920_2: C920.2 L65.1 U72.6(SW)
NetC923_1: C923.1 R821.1
NetC923_2: C923.2 R824.2 R830.1 U71.2(FB)
NetC924_1: C924.1 R825.1
NetC924_2: C924.2 R826.2 R832.1 U72.2(FB)
NetD13_CATHODE: D13.CATHODE R833.2
NetM14_3: M14.3(DRAIN) R833.1
NetR780_1: R780.1 U67.7(BOOT)
NetR781_1: R781.1 U67.1(EN)
NetR782_2: R782.2 R784.2 R787.1
NetR785_1: R785.1 U68.7(BOOT)
NetR786_2: R786.2 R791.2 R793.1
NetR788_1: R788.1 U68.1(EN)
NetR789_2: R789.2 U67.10(MODE)
NetR790_1: R790.1 U67.4(PG)
NetR794_1: R794.1 U68.4(PG)
NetR795_2: R795.2 U68.10(MODE)
NetR798_1: R798.1 U69.7(BOOT)
NetR799_1: R799.1 U69.1(EN)
NetR800_2: R800.2 R803.1 R804.2
NetR802_1: R802.1 U70.7(BOOT)
NetR805_1: R805.1 U70.1(EN)
NetR806_2: R806.2 R807.2 R810.1
NetR808_1: R808.1 U69.4(PG)
NetR809_2: R809.2 U69.10(MODE)
NetR812_1: R812.1 U70.4(PG)
NetR813_2: R813.2 U70.10(MODE)
NetR817_1: R817.1 U71.7(BOOT)
NetR818_1: R818.1 U71.1(EN)
NetR819_2: R819.2 R821.2 R824.1
NetR820_2: R820.2 R825.2 R826.1
NetR822_1: R822.1 U72.7(BOOT)
NetR823_1: R823.1 U72.1(EN)
NetR828_2: R828.2 U71.10(MODE)
NetR829_1: R829.1 U72.4(PG)
NetR831_2: R831.2 U72.10(MODE)

Not connected (* = marked no-connect by the designer): U67 5(NC)*; U68 5(NC)*; U69 5(NC)*; U70 5(NC)*; U71 5(NC)*; U72 5(NC)*

### Notes on the sheet
- SYSTEM POWER CONVERTORs
- ACB_0001_0

### Library data of the parts
*#38 = Title_block_PPC: Title: T2080PCIe; Schematic Page Count: 45; Schematic Page Number: 39; Author: MICETEK; Page Create Date: March  8, 1995; Page Title: ?; Page Modify Date: *
C876 C882 C883 C895 C899 C910 C920 = CAP NP_Dup2: as C816-C821 on sheet 27 Clock 2; Part Type: Capacitors\Ceramic\SMD\0402; PCB Footprint: SMD_0402
C877 C878 C889 C892 C893 C901 C902 C909 C915 C916 C922 = CAP NP_Dup2: as C814 on sheet 27 Clock 2; Part Type: Capacitors\Ceramic\SMD\0603; PCB Footprint: SMD_0603
C879 C887 C890 C894 C898 C900 C903 C906 C911 C914 C919 C921 = CAP NP_Dup2: as C812 on sheet 27 Clock 2; Part Type: Capacitors\Ceramic\SMD\0402; PCB Footprint: SMD_0402
C880 C886 C897 C905 C913 C918 = CAP NP_Dup2: CAP CER 47UF 10V 20% X5R 0805; Manufacturer Part Number 1: JMK212BJ476MG-T; Manufacturer 1: Taiyo Yuden; Part Number: PASSIVE_244; RSM: RC0805; Part Type: Capacitors\Ceramic\SMD\0805; PCB Footprint: SMD_0805
C881 C885 C896 C904 C912 C917 = CAP NP_Dup2: CAP CER 47UF 10V 20% X5R 0805; Part Number: PASSIVE_244; Manufacturer 1: Taiyo Yuden; Manufacturer Part Number 1: JMK212BJ476MG-T; RSM: RC0805; Part Type: Capacitors\Ceramic\SMD\0805; PCB Footprint: SMD_0805
C884 = CAP NP_Dup2: as C829 on sheet 28 Core Pwr; Part Type: Capacitors\Ceramic\SMD\0603; PCB Footprint: SMD_0603
C888 C891 C907 C908 C923 C924 = CAP NP_Dup2: COND.CER. 100PF 50V 0402 NPO 5% SMD; Part Number: PASSIVE_26; Manufacturer 1: Murata; Manufacturer Part Number 1: GRM1555C1H101JD01D; RSM: RC0402; Part Type: Capacitors\Ceramic\SMD\0402; PCB Footprint: SMD_0402
D13 = LED_1: LED CHIPLED VERDE 40mcd 570nm; Manufacturer Part Number 1: 598-8070-107F; Manufacturer 1: DIALIGHT; Part Number: DISCRETE_31; PCB Footprint: SMD_0603; RSM: LED0603-AK; Distributor 1: MOUSER(645-598-8070-107F); Part Type: Diodes\LED; TYPE: LED
JP3 JP5 JP6 = JUMPER_0: as JP1 on sheet 28 Core Pwr; Part Type: NODO; RSM: NODO
JP4 JP7 JP8 = JUMPER_0: Serve solo al masterista per collegare i gnd; Part Number: DA CODIFICARE; LNK_PART: SEZ0201_CHIUSO; RSM: NODO; Part Type: NODO; TECNO77: NODO
L60-L62 L65 = INDUCTOR_Dup1: FIXED IND 1UH 11A 16.5 Mohm SMD; Manufacturer Part Number 1: IHLP2525CZER1R0M01; Manufacturer 1: Vishay; Part Number: PASSIVE_1467; RSM: IND-VISHAY-IHLP2525; Part Type: Inductors\SMD\IHLP2525; PCB Footprint: SMD
L63 L64 = INDUCTOR_Dup1: FIXED IND 2.2UH 7A 16.5 Mohm SMD; Part Number: PASSIVE_513; Manufacturer 1: Vishay; Manufacturer Part Number 1: IHLP2525CZER2R2M1; RSM: IND-VISHAY-IHLP2525; Part Type: Inductors\SMD\IHLP2525; PCB Footprint: SMD
M14 = NMOS_SOT23: FDV301N N CHANNEL DIGITAL FET; Part Number: DISCRETE_196; Manufacturer 1: FAIRCHILD; Manufacturer Part Number 1: FDV301N  (ROHS COMPLIANT); RSM: SOT-23; Part Type: Mosfet\SOT23; Distributor 1: CLAITRON LASI SILVESTAR S.R.L; PCB Footprint: sot23
R779 = R_Dup5: RESIS. 0R 1/4W 1206 SMD E96; Part Number: PASSIVE_1266; Manufacturer 1: YAGEO; Manufacturer Part Number 1: RC1206JR-070RL; RSM: RC1206; Part Type: Resistors\Fixed\SMD\1206\5%; PCB Footprint: SMD_1206
R780 R785 R798 R802 R817 R822 = R_Dup5: RESIS.CHIP 0R 5% 0402 SMD; Manufacturer 1: ROYAL OHM; Part Number: PASSIVE_805; RSM: RC0402; Manufacturer Part Number 1: RESIS.CHIP 0R 5% 0402 SMD; Part Type: Resistors\Fixed\SMD\0402\5%; PCB Footprint: SMD_0402
R781 R788 R789 R795 R799 R805 R809 R813 R818 R823 R827 R828 R831 = R_Dup5: RESIS.CHIP 10K 1% 0402 SMD; Manufacturer 1: ROYAL OHM; Part Number: PASSIVE_584; RSM: RC0402; Manufacturer Part Number 1: RESIS.CHIP 10K 1% 0402 SMD; Part Type: Resistors\Fixed\SMD\0402\1%; PCB Footprint: SMD_0402
R782 R786 R800 R806 R819 R820 = R_Dup5: as R736 on sheet 28 Core Pwr; Part Type: Resistors\Fixed\SMD\0402\1%; PCB Footprint: SMD_0402
R783 R797 R801 R815 R816 = R_Dup5: as R735 on sheet 28 Core Pwr; Part Type: Resistors\Fixed\SMD\1206\5%; PCB Footprint: SMD_1206
R784 R791 R804 R807 R821 R825 = R_Dup5: as R742 on sheet 28 Core Pwr; Part Type: Resistors\Fixed\SMD\0402\1%; PCB Footprint: SMD_0402
R787 = R_Dup5: RES 7,5K OHM 1/10W 1% 0402 SMD; Manufacturer Part Number 1: CR0402-FX-7501GLF; Manufacturer 1: bourns; Part Number: PASSIVE_1468; RSM: RC0402; Part Type: Resistors\Fixed\SMD\0402\1%; PCB Footprint: SMD_0402
R790 R792 R794 R796 R803 R808 R811 R812 R814 R829 R830 R832 = R_Dup5: RESIS.CHIP 10K 1% 0402 SMD; Part Number: PASSIVE_584; Manufacturer 1: ROYAL OHM; RSM: RC0402; Part Type: Resistors\Fixed\SMD\0402\1%; Manufacturer Part Number 1: RESIS.CHIP 10K 1% 0402 SMD; PCB Footprint: SMD_0402
R793 = R_Dup5: RESIS.CHIP 12,4K 1% 0402 SMD; Manufacturer 1: ROYAL OHM; Part Number: PASSIVE_591; RSM: RC0402; Manufacturer Part Number 1: RESIS.CHIP 12,4K 1% 0402 SMD; Part Type: Resistors\Fixed\SMD\0402\1%; PCB Footprint: SMD_0402
R810 = R_Dup5: RESIS.CHIP 31,6K 1% 0402 SMD; Manufacturer Part Number 1: CRCW040231K6FKED; Manufacturer 1: Vishay/Dale; Part Number: PASSIVE_692; RSM: RC0402; Part Type: Resistors\Fixed\SMD\0402\1%; PCB Footprint: SMD_0402
R824 = R_Dup5: RESIS.CHIP 45,3K 1% 0402 SMD; Manufacturer Part Number 1: ERJ-2RKF4532X; Manufacturer 1: PANASONIC; Part Number: PASSIVE_731; RSM: RC0402; Part Type: Resistors\Fixed\SMD\0402\1%; PCB Footprint: SMD_0402
R826 = R_Dup5: RESIS.CHIP 73K2 1% 0402 SMD; Part Number: PASSIVE_781; Manufacturer 1: PANASONIC; Manufacturer Part Number 1: ERJ-2RKF7322X; RSM: RC0402; Part Type: Resistors\Fixed\SMD\0402\1%; PCB Footprint: SMD_0402
R833 = R_Dup5: RESIS.CHIP 510R 1% 0402 SMD; Part Number: PASSIVE_749; Manufacturer 1: ROYAL OHM; RSM: RC0402; Part Type: Resistors\Fixed\SMD\0402\1%; Manufacturer Part Number 1: RESIS.CHIP 510R 1% 0402 SMD; PCB Footprint: SMD_0402
U67-U72 = TPS56637: 4.5-V to 28-V input, 6-A synchronous buck; Manufacturer 1: TEXAS; Part Number: LINEAR_330; RSM: VQFN-10-3_1X3_1; Distributor 1: MOUSER(595-TPS56637RPAR); Manufacturer Part Number 1: TPS56637RPAR; Part Type: Regulators\Switching; PCB Footprint: VQFN10

## Sheet 30A Other Pwr 2.SchDoc
size 297 x 209 mm
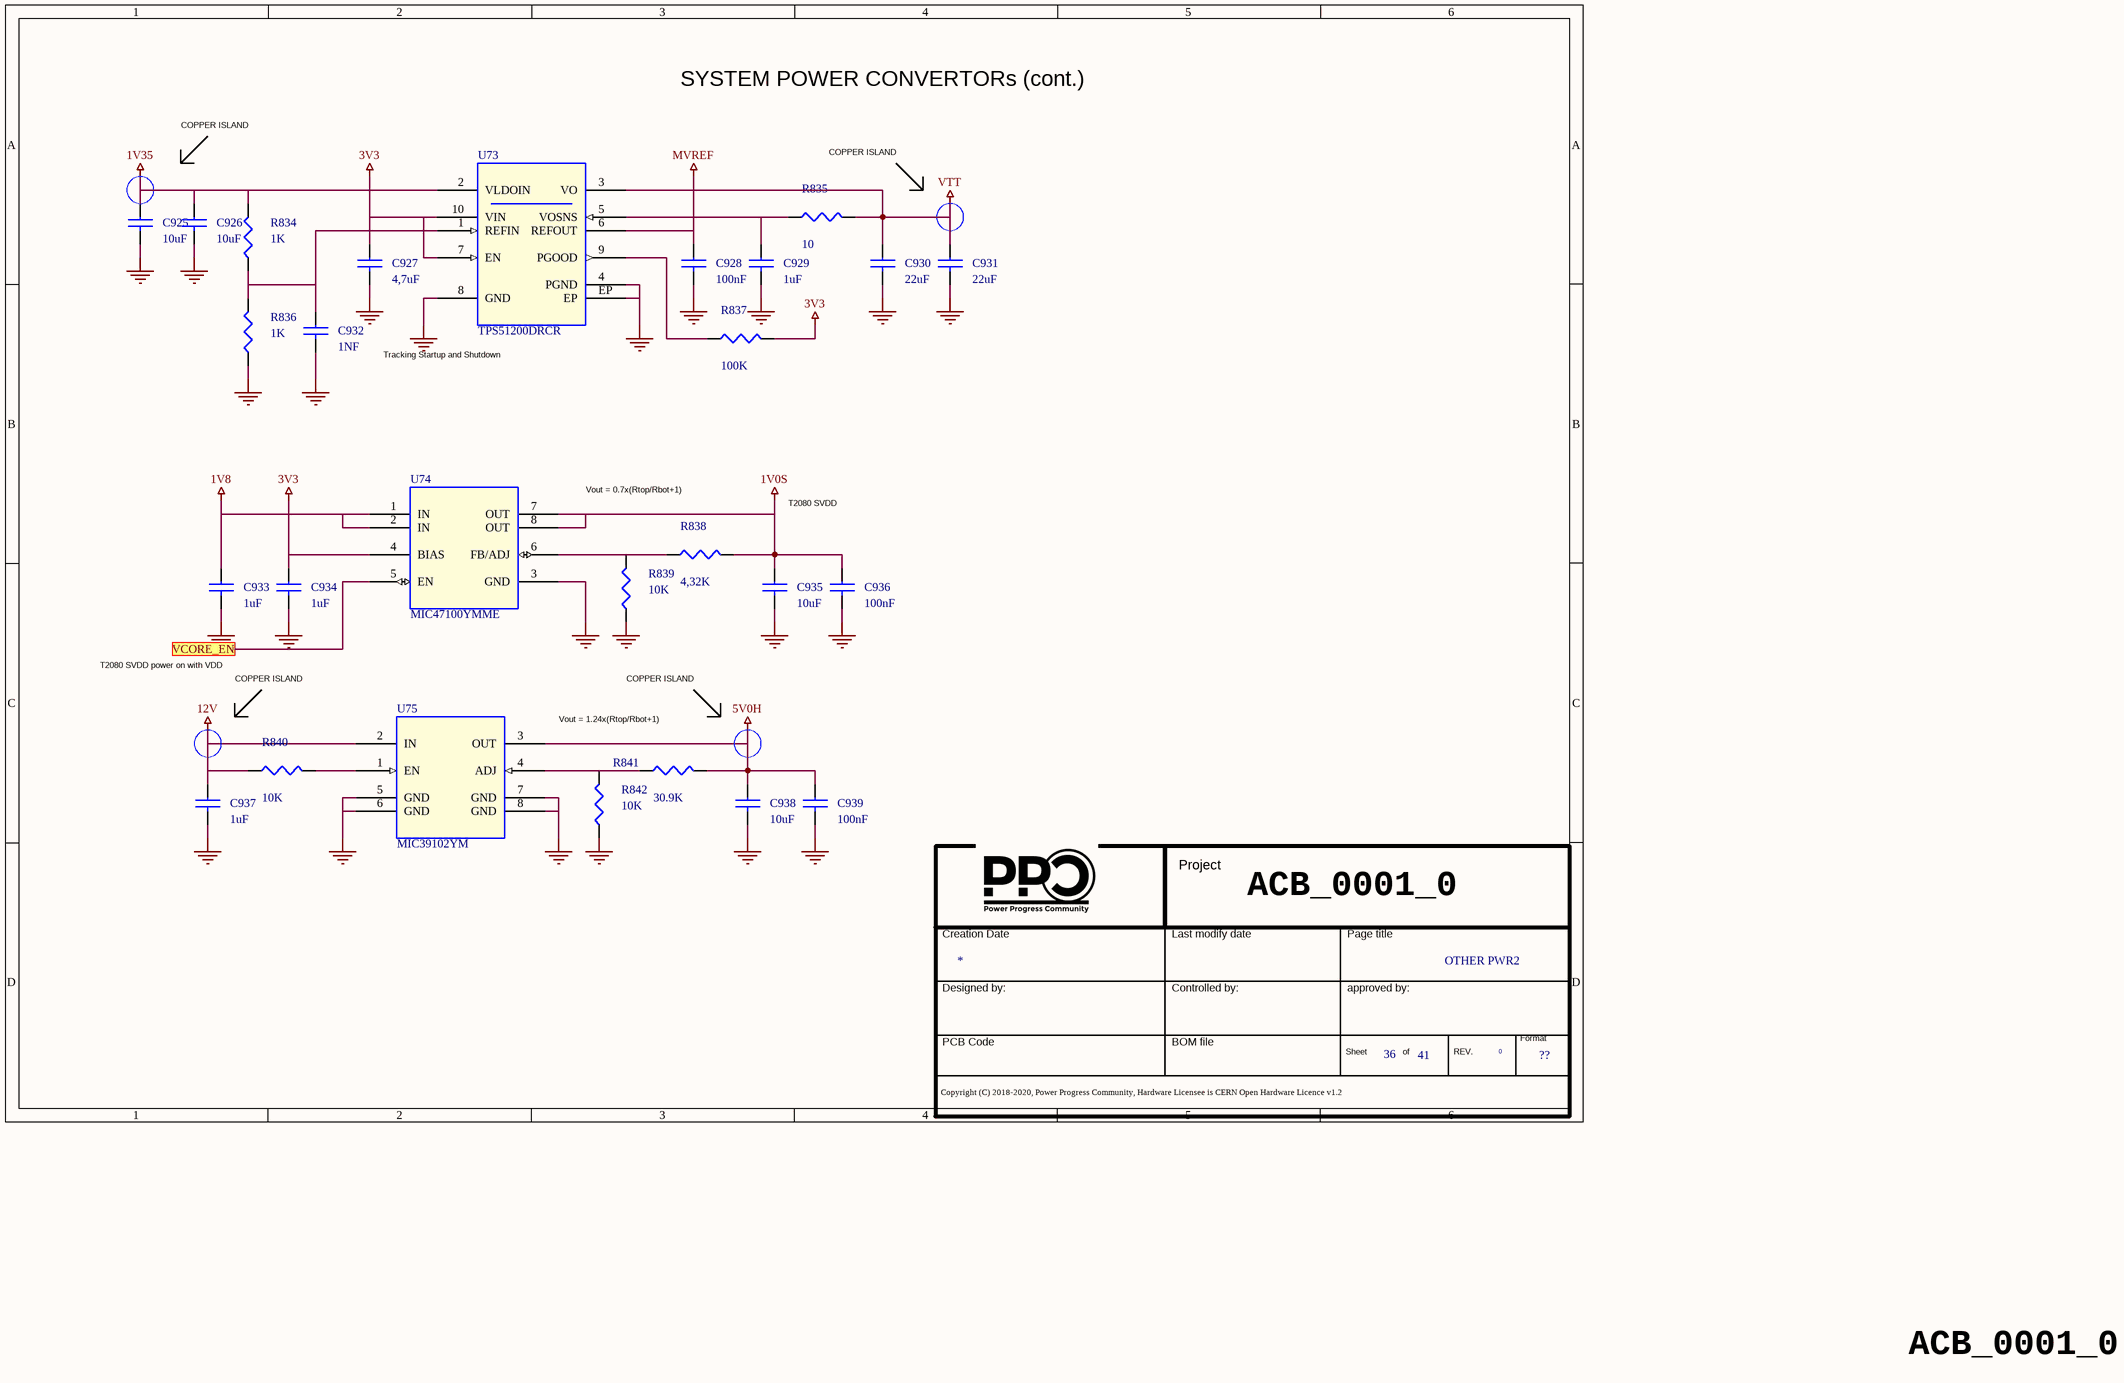
[diagram p62: 30A Other Pwr 2.SchDoc]

### Parts
(Parts that share a designator on the sheet are numbered #1, #2 ... from top to bottom, then left to right.)
*#39  Doc: OTHER PWR2  Page Count: 41  Page Number: 36  Page Size: ??  RevCode: 0  (hidden comment: Title_block_PPC)  (graphical)
C925  10uF  [SMD_0603]
C926  10uF  [SMD_0603]
C927  4,7uF  [SMD_0603]
C928  100nF  [SMD_0402]
C929  1uF  [SMD_0402]
C930  22uF  [SMD_0805]
C931  22uF  [SMD_0805]
C932  1NF  [SMD_0402]
C933  1uF  [SMD_0402]
C934  1uF  [SMD_0402]
C935  10uF  [SMD_0603]
C936  100nF  [SMD_0402]
C937  1uF  [SMD_0402]
C938  10uF  [SMD_0603]
C939  100nF  [SMD_0402]
R834  1K  [SMD_0402]
R835  10  [SMD_0402]
R836  1K  [SMD_0402]
R837  100K  [SMD_0402]
R838  4,32K  [SMD_0402]
R839  10K  [SMD_0402]
R840  10K  [SMD_0402]
R841  30.9K  [SMD_0402]
R842  10K  [SMD_0402]
U73  TPS51200DRCR  [QFN-10]
U74  MIC47100YMME  [msop_8]
U75  MIC39102YM  [SOIC-8]

### Ports
VCORE_EN

### Nets
1V0S: C935.1 C936.1 R838.2 U74.7(OUT) U74.8(OUT)
1V8: C933.1 U74.1(IN) U74.2(IN)
1V35: C925.1 C926.1 R834.2 U73.2(VLDOIN)
3V3: C927.1 C934.1 R837.2 U73.7(EN) U73.10(VIN) U74.4(BIAS)
5V0H: C938.1 C939.1 R841.2 U75.3(OUT)
12V: C937.1 R840.1 U75.2(IN)
GND: C925.2 C926.2 C927.2 C928.2 C929.2 C930.2 C931.2 C932.2 C933.2 C934.2 C935.2 C936.2 C937.2 C938.2 C939.2 R836.1 R839.1 R842.1 U73.4(PGND) U73.8(GND) U73.EP U74.3(GND) U75.5(GND) U75.6(GND) U75.7(GND) U75.8(GND)
MVREF: C928.1 U73.6(REFOUT)
VTT: C930.1 C931.1 R835.2 U73.3(VO)
NetC929_1: C929.1 R835.1 U73.5(VOSNS)
NetC932_1: C932.1 R834.1 R836.2 U73.1(REFIN)
NetR292_2: U74.5(EN) ; port VCORE_EN
NetR837_1: R837.1 U73.9(PGOOD)
NetR838_1: R838.1 R839.2 U74.6(FB/ADJ)
NetR840_2: R840.2 U75.1(EN)
NetR841_1: R841.1 R842.2 U75.4(ADJ)

### Notes on the sheet
- COPPER ISLAND
- SYSTEM POWER CONVERTORs (cont.)
- Tracking Startup and Shutdown
- Vout = 0.7x(Rtop/Rbot+1)
- T2080 SVDD
- T2080 SVDD power on with VDD
- Vout = 1.24x(Rtop/Rbot+1)
- ACB_0001_0

### Library data of the parts
*#39 = Title_block_PPC: Title: T2080PCIe; Schematic Page Count: 45; Schematic Page Number: 40; Author: MICETEK; Page Create Date: March  8, 1995; Page Title: ?; Page Modify Date: *
C925 C926 C935 C938 = CAP NP_Dup2: as C829 on sheet 28 Core Pwr; Part Type: Capacitors\Ceramic\SMD\0603; PCB Footprint: SMD_0603
C927 = CAP NP_Dup2: COND.CER.4,7uF 16V X5R 0603 SMD; Manufacturer Part Number 1: CL10A475KO8NNNC; Manufacturer 1: SAMSUNG; Part Number: PASSIVE_1405; RSM: RC0603; PCB Footprint: SMD_0603; Part Type: Capacitors\Ceramic\SMD\0603
C928 C936 = CAP NP_Dup2: as C812 on sheet 27 Clock 2; PCB Footprint: SMD_0402; Part Type: Capacitors\Ceramic\SMD\0402
C929 C933 C934 C937 = CAP NP_Dup2: CAP CER 1UF 25V X6S 0402; Part Number: PASSIVE_1446; Manufacturer 1: Murata; Manufacturer Part Number 1: GRM155C81E105KE11D; RSM: RC0402; Part Type: Capacitors\Ceramic\SMD\0402; PCB Footprint: SMD_0402
C930 C931 = CAP NP_Dup2: as C831 on sheet 28 Core Pwr; Part Type: Capacitors\Ceramic\SMD\0805; PCB Footprint: SMD_0805
C932 = CAP NP_Dup2: as C840 on sheet 28 Core Pwr; PCB Footprint: SMD_0402; Part Type: Capacitors\Ceramic\SMD\0402
C939 = CAP NP_Dup2: as C816-C821 on sheet 27 Clock 2; Part Type: Capacitors\Ceramic\SMD\0402; PCB Footprint: SMD_0402
R834 R836 = R_Dup5: RESIS.CHIP 1K 1% 0402 SMD; Manufacturer 1: ROYAL OHM; Part Number: PASSIVE_628; RSM: RC0402; Manufacturer Part Number 1: RESIS.CHIP 1K 1% 0402 SMD; Part Type: Resistors\Fixed\SMD\0402\1%; PCB Footprint: SMD_0402
R835 = R_Dup5: RESIS.CHIP 10R 5% 0402 SMD; Part Number: PASSIVE_811; Manufacturer 1: ROYAL OHM; RSM: RC0402; Part Type: Resistors\Fixed\SMD\0402\5%; Manufacturer Part Number 1: RESIS.CHIP 10R 5% 0402 SMD; PCB Footprint: SMD_0402
R837 = R_Dup5: RESIS.CHIP 100K 5% 0402 SMD; Manufacturer 1: ROYAL OHM; Part Number: PASSIVE_813; RSM: RC0402; PCB Footprint: SMD_0402; Manufacturer Part Number 1: RESIS.CHIP 100K 5% 0402 SMD; Part Type: Resistors\Fixed\SMD\0402\5%
R838 = R_Dup5: RESIS.CHIP 4,32K 0402 1% SMD; Part Number: PASSIVE_716; Manufacturer 1: PANASONIC; Manufacturer Part Number 1: ERJ-2RKF4321X; RSM: RC0402; Part Type: Resistors\Fixed\SMD\0402\1%; PCB Footprint: SMD_0402
R839 R840 R842 = R_Dup5: as R781 on sheet 29 Other Pwr 1; PCB Footprint: SMD_0402; Manufacturer Part Number 1: RESIS.CHIP 10K 1% 0402 SMD; Part Type: Resistors\Fixed\SMD\0402\1%
R841 = R_Dup5: RESIS.CHIP 30.9K 1% 0402 SMD; Part Number: PASSIVE_1452; Manufacturer 1: bourns; Manufacturer Part Number 1: ERJ-1GNF3092C; RSM: RC0402; Part Type: Resistors\Fixed\SMD\0402\1%; PCB Footprint: SMD_0402
U73 = TPS51200_1: IC CONV DDR DDR2 DDR3 10SON; MPN: TPS51200DRCT; Part Number: LINEAR_222; Manufacturer 1: TEXAS; PCB Footprint: SON10; RSM: VSON-10-3_1x3_1; Vendor: TI; TYPE: IC; Part Type: Regulators\Switching; Manufacturer Part Number 1: TPS51200DRCR; Distributor 1: DIGIKEY (296-26978-1-ND)
U74 = MIC47100-MSOP8: LDO 1A High Speed, Low Vin LDO; Manufacturer 1: MICROCHIP; Part Number: LINEAR_328; MPN: MIC49150YMM; PCB Footprint: MSOP8; Vendor: Micrel; RSM: MSOP-8-EP; Distributor 1: MOUSER(998-MIC47100YMME); Manufacturer Part Number 1: MIC47100YMME; Part Type: Regulators\LDO; TYPE: IC
U75 = MIC39102-SOIC: LDO 1.0A 1.0% Fixed Voltage LDO; Part Number: LINEAR_329; Manufacturer 1: MICROCHIP; RSM: SO-8; Vendor: Micrel; PCB Footprint: SOIC8; MPN: MIC39102YM; TYPE: IC; Part Type: Regulators\LDO; Manufacturer Part Number 1: MIC39102YM; Distributor 1: MOUSER(998-MIC39102YM)

## Sheet 30B Main Power.SchDoc
size 420 x 297 mm
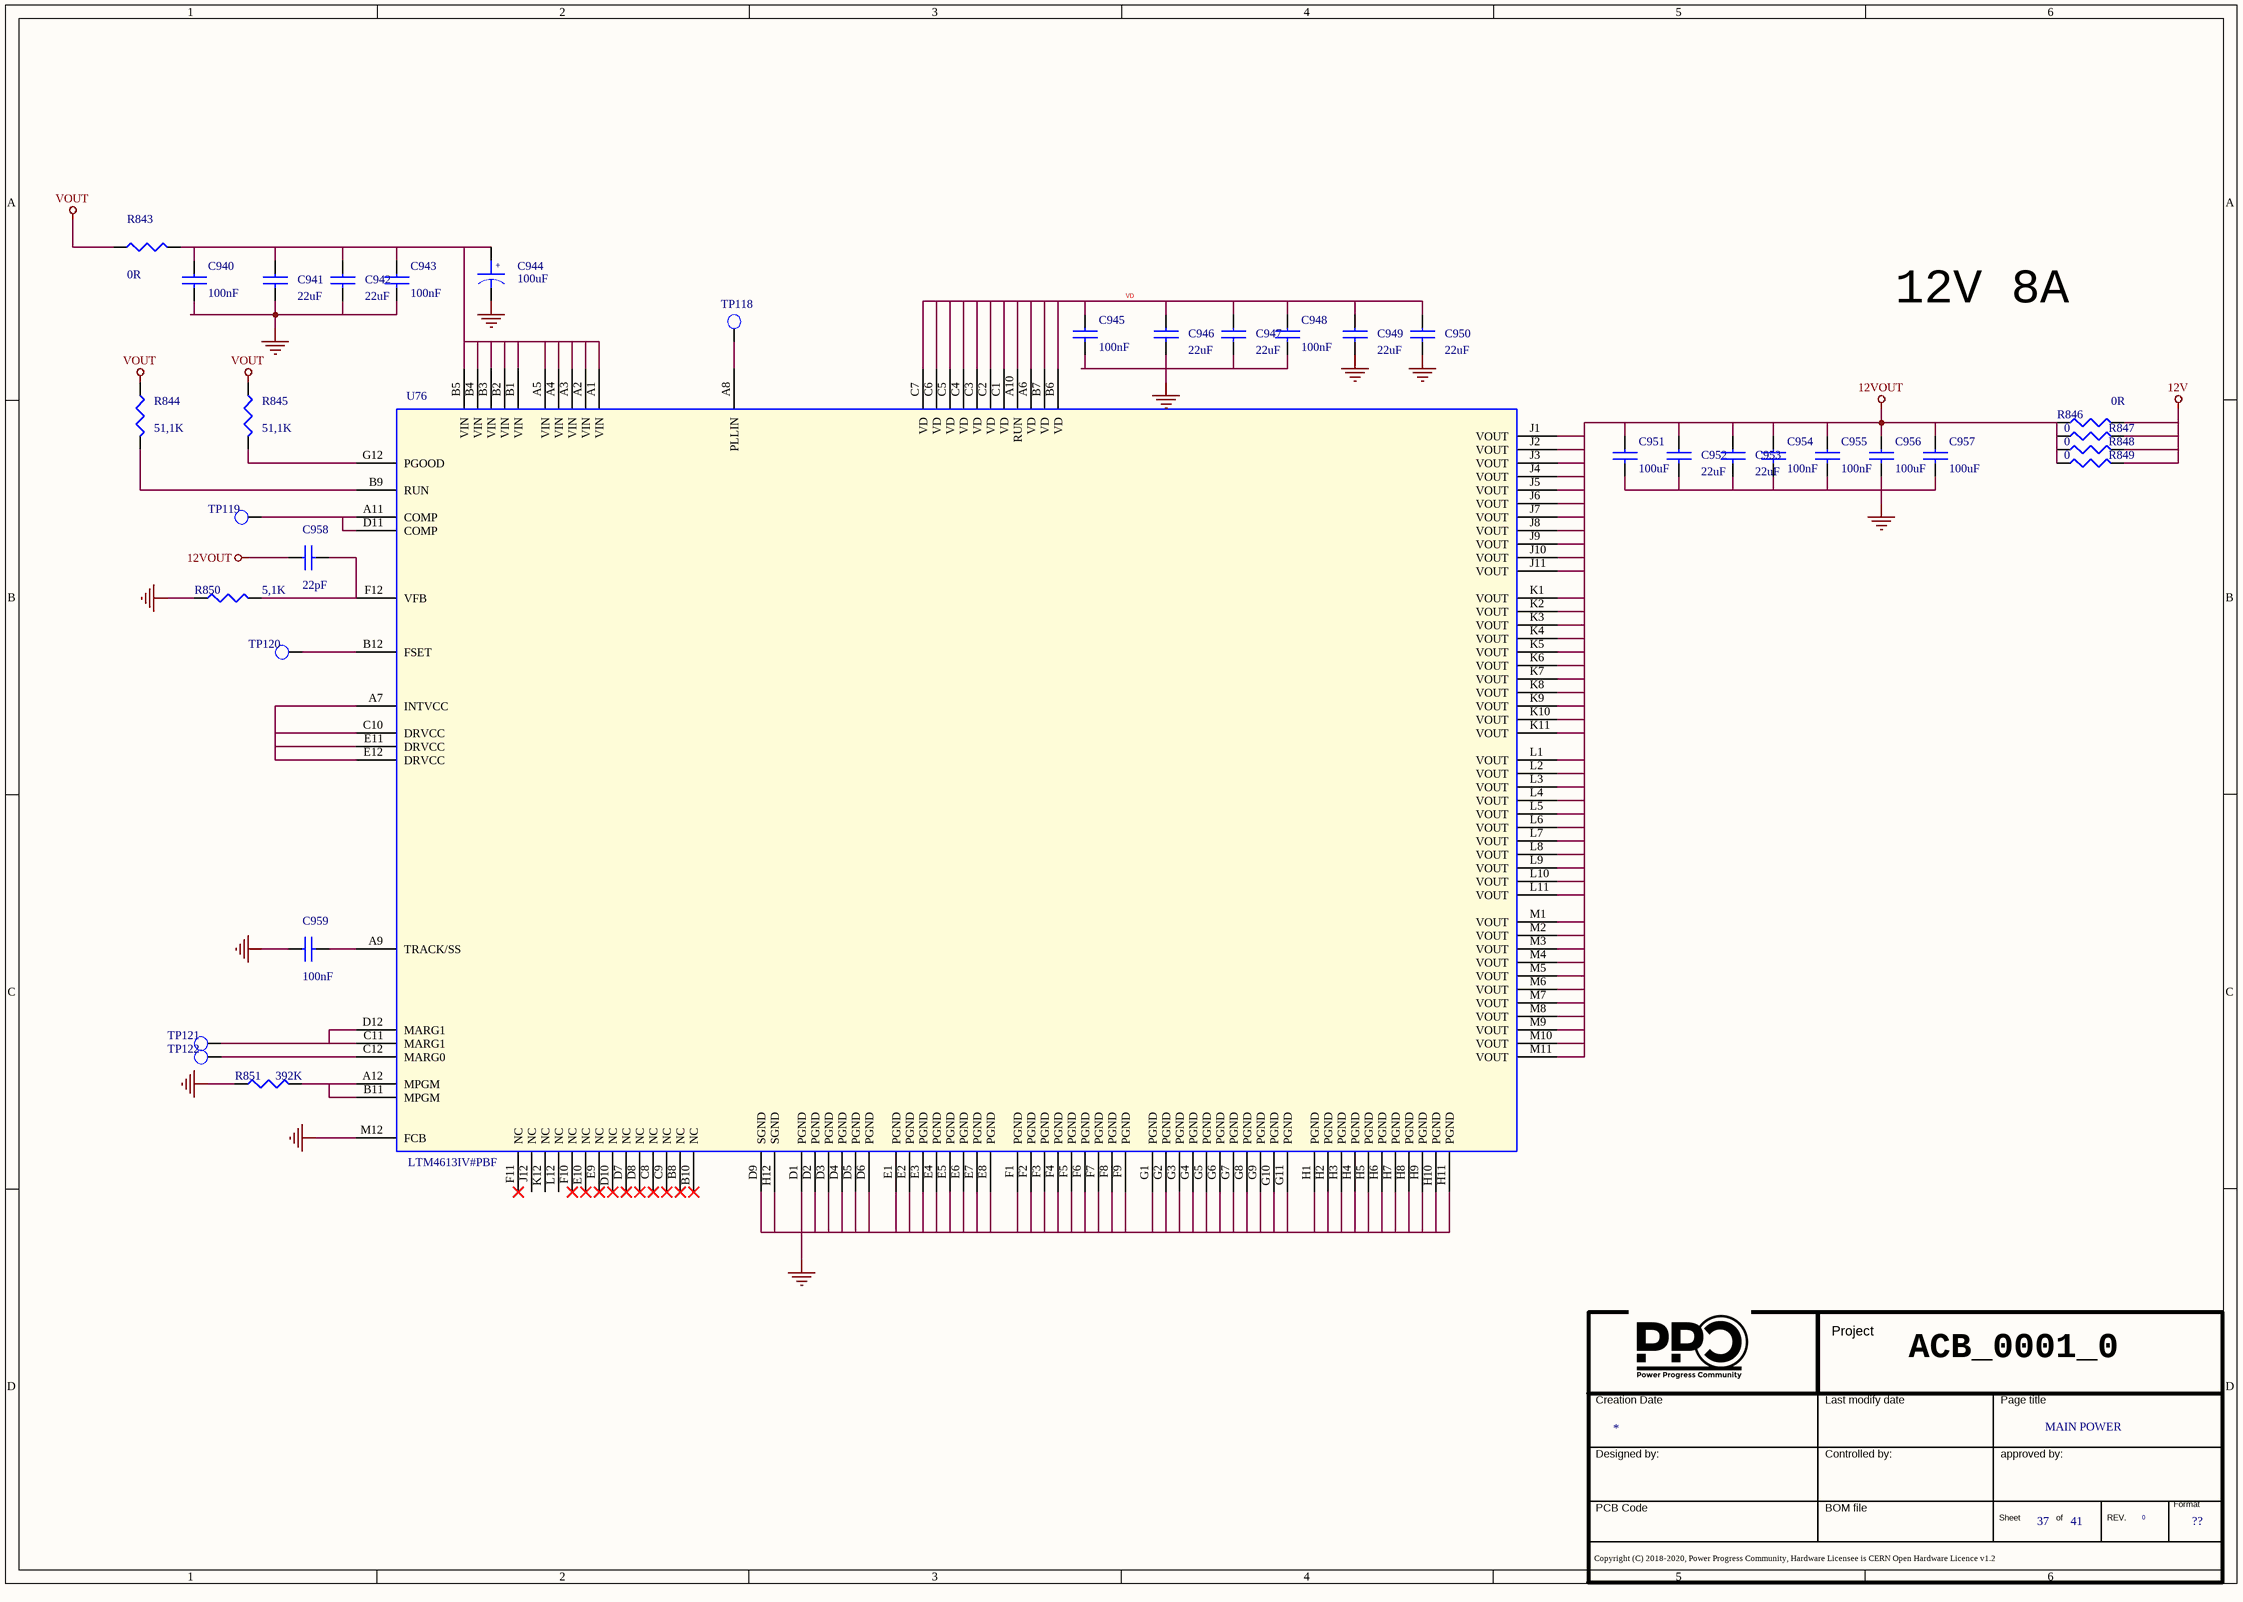
[diagram p63: 30B Main Power.SchDoc]

### Parts
(Parts that share a designator on the sheet are numbered #1, #2 ... from top to bottom, then left to right.)
*#40  Doc: MAIN POWER  Page Count: 41  Page Number: 37  Page Size: ??  RevCode: 0  (hidden comment: Title_block_PPC)  (graphical)
C940  100nF  [SMD_0402]
C941  22uF  [SMD_0805]
C942  22uF  [SMD_0805]
C943  100nF  [SMD_0402]
C944  100uF  [SMD_6.3X6.3x6.1]
C945  100nF  [SMD_0402]
C946  22uF  [SMD_0805]
C947  22uF  [SMD_0805]
C948  100nF  [SMD_0402]
C949  22uF  [SMD_0805]
C950  22uF  [SMD_0805]
C951  100uF  [SMD_1210]
C952  22uF  [SMD_0805]
C953  22uF  [SMD_0805]
C954  100nF  [SMD_0402]
C955  100nF  [SMD_0402]
C956  100uF  [SMD_1210]
C957  100uF  [SMD_1210]
C958  22pF  [SMD_0402]
C959  100nF  [SMD_0402]
R843  0R  [SMD_2512]
R844  51,1K  [SMD_0402]
R845  51,1K  [SMD_0402]
R846  0R  [SMD_2512]
R847  0  [SMD_1206]
R848  0  [SMD_1206]
R849  0  [SMD_1206]
R850  5,1K  [SMD_0402]
R851  392K  [SMD_0402]
TP118  TEST POINT  [PCB]  (value not drawn)
TP119  TEST POINT  [PCB]  (value not drawn)
TP120  TEST POINT  [PCB]  (value not drawn)
TP121  TEST POINT  [PCB]  (value not drawn)
TP122  TEST POINT  [PCB]  (value not drawn)
U76  LTM4613IV#PBF  [LGA-133]

### Nets
12V: R846.2 R847.1 R848.1 R849.1
12VOUT: C951.1 C952.1 C953.1 C954.1 C955.1 C956.1 C957.1 C958.1 R846.1 R847.2 R848.2 R849.2 U76.J1(VOUT) U76.J2(VOUT) U76.J3(VOUT) U76.J4(VOUT) U76.J5(VOUT) U76.J6(VOUT) U76.J7(VOUT) U76.J8(VOUT) U76.J9(VOUT) U76.J10(VOUT) U76.J11(VOUT) U76.K1(VOUT) U76.K2(VOUT) U76.K3(VOUT) U76.K4(VOUT) U76.K5(VOUT) U76.K6(VOUT) U76.K7(VOUT) U76.K8(VOUT) U76.K9(VOUT) U76.K10(VOUT) U76.K11(VOUT) U76.L1(VOUT) U76.L2(VOUT) U76.L3(VOUT) U76.L4(VOUT) U76.L5(VOUT) U76.L6(VOUT) U76.L7(VOUT) U76.L8(VOUT) U76.L9(VOUT) U76.L10(VOUT) U76.L11(VOUT) U76.M1(VOUT) U76.M2(VOUT) U76.M3(VOUT) U76.M4(VOUT) U76.M5(VOUT) U76.M6(VOUT) U76.M7(VOUT) U76.M8(VOUT) U76.M9(VOUT) U76.M10(VOUT) U76.M11(VOUT)
GND: C940.2 C941.2 C942.2 C943.2 C944.2 C945.2 C946.2 C947.2 C948.2 C949.2 C950.2 C956.2 C959.1 R850.1 R851.1 U76.D1(PGND) U76.D2(PGND) U76.D3(PGND) U76.D4(PGND) U76.D5(PGND) U76.D6(PGND) U76.D9(SGND) U76.E1(PGND) U76.E2(PGND) U76.E3(PGND) U76.E4(PGND) U76.E5(PGND) U76.E6(PGND) U76.E7(PGND) U76.E8(PGND) U76.F1(PGND) U76.F2(PGND) U76.F3(PGND) U76.F4(PGND) U76.F5(PGND) U76.F6(PGND) U76.F7(PGND) U76.F8(PGND) U76.F9(PGND) U76.G1(PGND) U76.G2(PGND) U76.G3(PGND) U76.G4(PGND) U76.G5(PGND) U76.G6(PGND) U76.G7(PGND) U76.G8(PGND) U76.G9(PGND) U76.G10(PGND) U76.G11(PGND) U76.H1(PGND) U76.H2(PGND) U76.H3(PGND) U76.H4(PGND) U76.H5(PGND) U76.H6(PGND) U76.H7(PGND) U76.H8(PGND) U76.H9(PGND) U76.H10(PGND) U76.H11(PGND) U76.H12(SGND) U76.M12(FCB)
VOUT: R843.1 R844.1 R845.1
VD: C945.1 C946.1 C947.1 C948.1 C949.1 C950.1 U76.A6(VD) U76.A10(RUN) U76.B6(VD) U76.B7(VD) U76.C1(VD) U76.C2(VD) U76.C3(VD) U76.C4(VD) U76.C5(VD) U76.C6(VD) U76.C7(VD)
NetC940_1: C940.1 C941.1 C942.1 C943.1 C944.1 R843.2 U76.A1(VIN) U76.A2(VIN) U76.A3(VIN) U76.A4(VIN) U76.A5(VIN) U76.B1(VIN) U76.B2(VIN) U76.B3(VIN) U76.B4(VIN) U76.B5(VIN)
NetC951_2: C951.2 C952.2 C953.2 C954.2 C955.2 C957.2
NetC958_2: C958.2 R850.2 U76.F12(VFB)
NetC959_2: C959.2 U76.A9(TRACK/SS)
NetR844_2: R844.2 U76.B9(RUN)
NetR845_2: R845.2 U76.G12(PGOOD)
NetR851_2: R851.2 U76.A12(MPGM) U76.B11(MPGM)
NetTP118_1: TP118.1(TP) U76.A8(PLLIN)
NetTP119_1: TP119.1(TP) U76.A11(COMP) U76.D11(COMP)
NetTP120_1: TP120.1(TP) U76.B12(FSET)
NetTP121_1: TP121.1(TP) U76.C11(MARG1) U76.D12(MARG1)
NetTP122_1: TP122.1(TP) U76.C12(MARG0)
NetU76_A7: U76.A7(INTVCC) U76.C10(DRVCC) U76.E11(DRVCC) U76.E12(DRVCC)

Not connected (* = marked no-connect by the designer): U76 B8(NC)* B10(NC)* C8(NC)* C9(NC)* D7(NC)* D8(NC)* D10(NC)* E9(NC)* E10(NC)* F10(NC)* F11(NC)* J12(NC) K12(NC) L12(NC)

### Notes on the sheet
- 12V 8A
- ACB_0001_0
- (in symbol CAP POL) +

### Library data of the parts
*#40 = Title_block_PPC: Title: PORTATILE ACUBE; Schematic Page Count: 45; Author: MICETEK; Page Create Date: March  8, 1995; Page Title: ?; Page Modify Date: *; Schematic Page Number: 41
C940 C943 C945 C948 = CAP NP_Dup9: COND.CER. 100NF 50V 0402 X7R SMD; Manufacturer Part Number 1: CGA2B3X7R1H104M050BD; Manufacturer 1: TDK; Part Number: PASSIVE_24; RSM: RC0402; PCB Footprint: SMD_0402; Distributor 1: DIGKEY (445-9694-2-ND); Part Type: Capacitors\Ceramic\SMD\0402
C941 C942 C946 C947 C949 C950 C952 C953 = CAP NP_Dup2: as C831 on sheet 28 Core Pwr; Part Type: Capacitors\Ceramic\SMD\0805; PCB Footprint: SMD_0805
C944 = CAP POL: CAP ALUM 100UF 35V 20% SMD; Part Number: PASSIVE_1410; Manufacturer 1: PANASONIC; Manufacturer Part Number 1: EEE-FT1V101AP; RSM: CE-6_3X6_3; PCB Footprint: SMD_6.3X6.3x6.1; Part Type: Capacitors\Aluminium\SMD
C951 = CAP NP_Dup9: CAP CER 100UF 16V 20% X5R 1210; Part Number: PASSIVE_264; Manufacturer 1: Taiyo Yuden; Manufacturer Part Number 1: EMK325ABJ107MM-T; RSM: RC1210; PCB Footprint: SMD_1210; Part Type: Capacitors\Ceramic\SMD\1210; Distributor 1: DIGIKEY (587-3152-2-ND)
C954 C955 = CAP NP_Dup9: COND.CER. 100NF 50V 0402 X7R SMD; Part Number: PASSIVE_24; Manufacturer 1: TDK; Manufacturer Part Number 1: CGA2B3X7R1H104M050BD; RSM: RC0402; PCB Footprint: SMD_0402; Part Type: Capacitors\Ceramic\SMD\0402; Distributor 1: DIGKEY (445-9694-2-ND)
C956 C957 = CAP NP_Dup2: CAP CER 100UF 16V 20% X5R 1210; Manufacturer Part Number 1: EMK325ABJ107MM-T; Manufacturer 1: Taiyo Yuden; Part Number: PASSIVE_264; RSM: RC1210; PCB Footprint: SMD_1210; Part Type: Capacitors\Ceramic\SMD\1210
C958 = CAP NP_Dup2: COND.CER. 22PF 50V 0402 NPO 5% SMD; Manufacturer Part Number 1: GRM1555C1H220JZ01; Manufacturer 1: Murata; Part Number: PASSIVE_65; RSM: RC0402; PCB Footprint: SMD_0402; Part Type: Capacitors\Ceramic\SMD\0402
C959 = CAP NP_Dup2: as C812 on sheet 27 Clock 2; PCB Footprint: SMD_0402; Part Type: Capacitors\Ceramic\SMD\0402
R843 R846 = R_Dup8: Thick Film Resistors 0OHM 1WATT 5%; Manufacturer Part Number 1: CR2512-J/-000ELF; Manufacturer 1: bourns; Part Number: PASSIVE_1318; RSM: RC2512; PCB Footprint: SMD_2512; Distributor 1: MOUSER(652-CR2512-J/-000ELF); Part Type: Resistors\Fixed\SMD\2512\1%
R844 R845 = R_Dup5: RESIS.CHIP 51K1 1% 0402 SMD; Part Number: PASSIVE_748; Manufacturer 1: ROYAL OHM; Manufacturer Part Number 1: CAMEL ELETTRONICA SRL  #; RSM: RC0402; PCB Footprint: SMD_0402; Part Type: Resistors\Fixed\SMD\0402\1%
R847-R849 = R_Dup5: RESIS. 0R 1/4W 1206 SMD E96; Manufacturer Part Number 1: CR32000ZL; Manufacturer 1: ASJ; Part Number: PASSIVE_1266; RSM: RC1206; PCB Footprint: SMD_1206; Part Type: Resistors\Fixed\SMD\1206\5%
R850 = R_Dup5: RES SMD 5.1K OHM 1% 1/16W 0402; Part Number: PASSIVE_742; Manufacturer 1: YAGEO; Manufacturer Part Number 1: RC0402FR-075K1L; RSM: RC0402; PCB Footprint: SMD_0402; Part Type: Resistors\Fixed\SMD\0402\1%
R851 = R_Dup5: RES 392K OHM 1/10W 1% 0402 SMD; Manufacturer Part Number 1: CRCW0402392KFKED; Manufacturer 1: Vishay; Part Number: PASSIVE_713; RSM: RC0402; PCB Footprint: SMD_0402; Part Type: Resistors\Fixed\SMD\0402\1%
TP118-TP122 = T POINT R: TEST POINT SU PCB; Part Number: CONNECTORS_542; RSM: AE-TESTPOINT; PCB Footprint: PCB; Part Type: Tpoint
U76 = LTM4613: Ultralow EMI, 36V, 8A Step-down Module; Manufacturer 1: ANALOG; Part Number: LINEAR_324; RSM: LGA-133-15X15; Distributor 1: MOUSER(584-LTM4613IV#PBF); Manufacturer Part Number 1: LTM4613IV#PBF; Part Type: Regulators\MODULE; PCB Footprint: LGA-133